# Altium project RFC_MB.PrjPcb (part 3 of 7)

## Sheet ethernet_1gbe_ext_magn.SchDoc
size A4
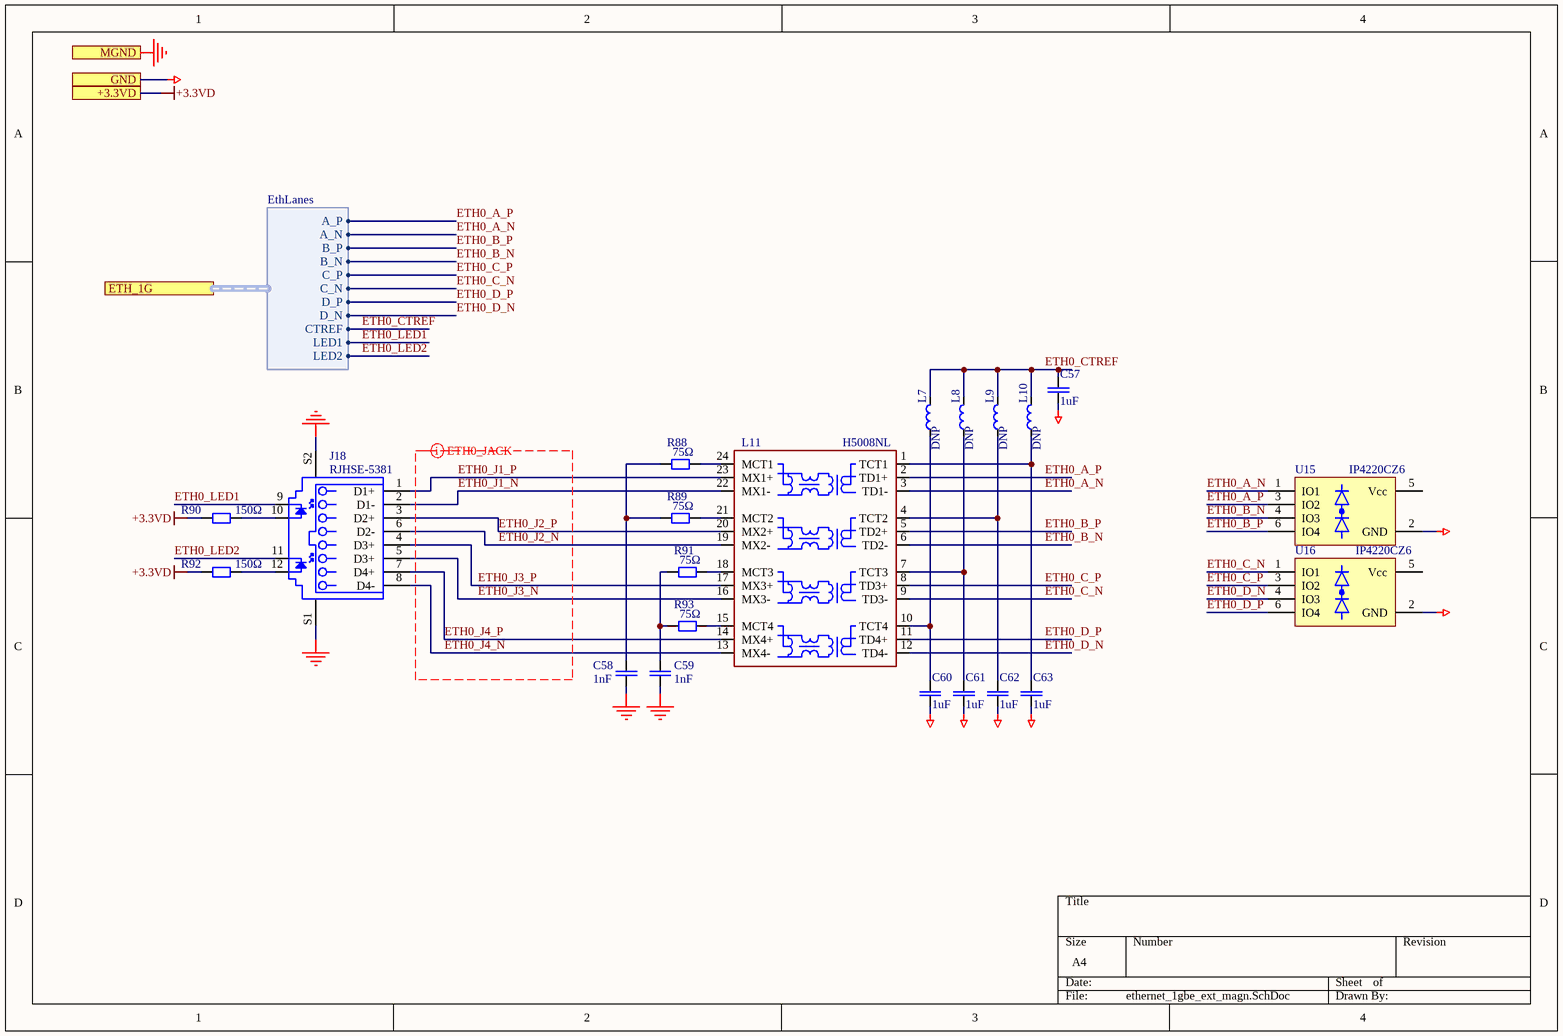
[diagram p4: ethernet_1gbe_ext_magn.SchDoc]

### Parts
C57  1uF  [CAPC2012N]
C58  value 1nF  [CAPC3216N]  (hidden comment: 1nF; 2kV)
C59  value 1nF  [CAPC3216N]  (hidden comment: 1nF; 2kV)
C60  1uF  [CAPC2012N]
C61  1uF  [CAPC2012N]
C62  1uF  [CAPC2012N]
C63  1uF  [CAPC2012N]
J18  RJHSE-5381  [AMPH-RJHSE-5381_V]
L7  DNP  [INDC2012N]
L8  DNP  [INDC2012N]
L9  DNP  [INDC2012N]
L10  DNP  [INDC2012N]
L11  H5008NL  [SMD_HX508]
R88  75Ω  [RESC2012N]
R89  75Ω  [RESC2012N]
R90  150Ω  [RESC2012N]
R91  75Ω  [RESC2012N]
R92  150Ω  [RESC2012N]
R93  75Ω  [RESC2012N]
U15  IP4220CZ6  [SOT95P285X110-6N]
U16  IP4220CZ6  [SOT95P285X110-6N]

### Ports
+3.3VD, ETH_1G (harness EthLanes), GND, MGND

### Harnesses
EthLanes: A_P, A_N, B_P, B_N, C_P, C_N, D_P, D_N, LED1, LED2, CTREF

### Nets
+3.3VD: R90.1 R92.1 ; port +3.3VD
GND: C57.1 C60.1 C61.1 C62.1 C63.1 U15.2(GND) U16.2(GND) ; port GND
MGND: C58.1 C59.1 J18.S1 J18.S2 ; port MGND
ETH0_A_N: L11.3(TD1-) U15.1(IO1) ; port ETH_1G.A_N
ETH0_A_P: L11.2(TD1+) U15.3(IO2) ; port ETH_1G.A_P
ETH0_B_N: L11.6(TD2-) U15.4(IO3) ; port ETH_1G.B_N
ETH0_B_P: L11.5(TD2+) U15.6(IO4) ; port ETH_1G.B_P
ETH0_C_N: L11.9(TD3-) U16.1(IO1) ; port ETH_1G.C_N
ETH0_C_P: L11.8(TD3+) U16.3(IO2) ; port ETH_1G.C_P
ETH0_CTREF: C57.2 L7.2 L8.2 L9.2 L10.2 ; port ETH_1G.CTREF
ETH0_D_N: L11.12(TD4-) U16.4(IO3) ; port ETH_1G.D_N
ETH0_D_P: L11.11(TD4+) U16.6(IO4) ; port ETH_1G.D_P
ETH0_J1_N: J18.2(D1-) L11.22(MX1-)
ETH0_J1_P: J18.1(D1+) L11.23(MX1+)
ETH0_J2_N: J18.6(D2-) L11.19(MX2-)
ETH0_J2_P: J18.3(D2+) L11.20(MX2+)
ETH0_J3_N: J18.5(D3+) L11.16(MX3-)
ETH0_J3_P: J18.4(D3+) L11.17(MX3+)
ETH0_J4_N: J18.8(D4-) L11.13(MX4-)
ETH0_J4_P: J18.7(D4+) L11.14(MX4+)
ETH0_LED1: J18.9 ; port ETH_1G.LED1
ETH0_LED2: J18.11 ; port ETH_1G.LED2
NetC58_2: C58.2 R88.1 R89.1
NetC59_2: C59.2 R91.1 R93.1
NetC60_2: C60.2 L7.1 L11.10(TCT4)
NetC61_2: C61.2 L8.1 L11.7(TCT3)
NetC62_2: C62.2 L9.1 L11.4(TCT2)
NetC63_2: C63.2 L10.1 L11.1(TCT1)
NetJ18_10: J18.10 R90.2
NetJ18_12: J18.12 R92.2
NetL11_15: L11.15(MCT4) R93.2
NetL11_18: L11.18(MCT3) R91.2
NetL11_21: L11.21(MCT2) R89.2
NetL11_24: L11.24(MCT1) R88.2

Not connected (* = marked no-connect by the designer): U15 5(Vcc); U16 5(Vcc)

### Layout directives
differential pair; rule Differential Pairs Routing [Pref Gap = 0.254mm    Min Gap  = 0.075mm    Max Gap  = 0.254mmPref Width = 0.3mm    Min Width  = 0.075mm    Max Width  = 0.5mm]: ETH0_J1_N, ETH0_J1_P, ETH0_J2_N, ETH0_J2_P, ETH0_J3_N, ETH0_J3_P, ETH0_J4_N, ETH0_J4_P

### Library data of the parts
C57 C60-C63 = CAPC: Generic ceramic SMD capacitor; Pkg: 0805; Maintainer: Evgeniy Kotov; SMD Solders: 2; THD Solders: 0; Voltage Rating: 10V; PartField: 1uF; Last Change Data: 06.03.2017; Release Date: 06.03.2017; Value: 1uF
C58 = CAPC: Generic ceramic SMD capacitor / +' x '+Voltage Rating; Pkg: 1206; Maintainer: Evgeniy Kotov; SMD Solders: 2; THD Solders: 0; PartField: 1nF; Last Change Data: 06.03.2017; Release Date: 06.03.2017; VoltageRating: 2kV
C59 = CAPC: Generic ceramic SMD capacitor; Pkg: 1206; Maintainer: Evgeniy Kotov; SMD Solders: 2; THD Solders: 0; PartField: 1nF; Last Change Data: 06.03.2017; Release Date: 06.03.2017; VoltageRating: 2kV
J18 = RJ45-RJHSE-5381: High Speed RJ45, Modular Jack, 8 Position, 8 Contacts, Shielded, with LEDs, -55 to 85 degC,12-Pin THD, RoHS, Tray; Manufacturer: Amphenol; Number of Positions/Contacts: 8p8c(RJ45,Ethernet); Number of Ports: 1; Catalog Drawings: RJ45SeriesRightAngle; PCN Design/Specification: MultipleSeriesCopper29/Jan/2009RJHSEShieldMaterial30/Jun/2015; Other Names: RJHSE5381; Online Catalog: RJHSESeries; Featured Product: ModularJacksProductSolutions; Tab Direction: Up; Shielding: Shielded,EMIFinger; LED Color: Yellow-Green; 3D Model: RJHSE538x.stpRJHSE538x.igs; Pkg: LAN conn; SMD Solders: 0; THD Solders: 14; Category: Connectors,Interconnects; Termination: Solder; Housing Material: Thermoplastic; Mounting Type: ThroughHole; Family: ModularConnectors-Jacks; Orientation: 90°Angle(Right); Features: BoardLock; Contact Material: PhosphorBronze; Mounting Technology: ThroughHole; Number of Rows: 1; Standard Package: 120; Ratings: -; Operating Temperature: -55°C~85°C; Series: RJHSE; Contact Finish: Gold; Package Reference: RJHSE-5381; Ingress Protection: -; Package Description: 12-Pin Through Hole Device, Body 16.51 x 15.75 mm; Contact Finish Thickness: 50µin(1.27µm); Datasheet URL: https://datasheet.ciiva.com/16481/rjhse538x-16481714.pdf; Datasheet Version: Rev. K, 04/2014; Connector Type: Jack; Manufacturer URL: http://www.amphenol.com/; Packaging: Tray; PartField: RJHSE-5381; Value: RJHSE-5381
L7-L10 = BLM21RK102SN1D: Ferrite Beads, 0805, 1 kOhm; Pkg: 0805; Vendor: Murata; Maintainer: Evgeniy Kotov; SMD Solders: 2; THD Solders: 0; DC Current: 200mA; Tolerance: 25%; DC Resistance: 500mΩ; PartField: BLM21RK102SN1D; Release Date: 30.03.2017; Last Change Data: 30.03.2017; Temperature Range: -55°C to +125°C; Value: DNP
L11 = LAN_1G_TR_H5008NL: LAN Transformer fog 1GbE, 12 coils, 4 pairs.; Vendor: Pulse Electronics; Maintainer: Evgeniy Kotov; SMD Solders: 2; THD Solders: 0; Tolerance: 2%; PartField: H5008NL; Pkg: H5008NL; Release Date: 31.03.2017; Last Change Data: 31.03.2017; Temperature Range: -25°C to +85°C; Value: H5008NL
R88-R93 = RESC: Resistor, Generic, SMD; Pkg: 0805; Maintainer: Evgeniy Kotov; SMD Solders: 2; THD Solders: 0; Release Date: 06.03.2017; Last Change Data: 09.03.2017
  R88 R89 R91 R93: PartField: 75Ω; Value: 75Ω
  R90 R92: PartField: 150Ω; Value: 150Ω
U15 U16 = IP4220CZ6: Transimpedance Amplifier; Selectable-Feedback Resistance; Pkg: SOT457; SMD Solders: 6; THD Solders: 0; Maintainer: Evgeniy Kotov; Vendor: NXP; PartField: IP4220CZ6; ComponentLink1URL: http://assets.nexperia.com/documents/data-sheet/IP4220CZ6.pdf; ComponentLink1Description: Datasheet; Last Change Date: 28.03.2017; Release Date: 28.03.2017; Value: IP4220CZ6

## Sheet ethernet_dual_100mbe_ext_magn.SchDoc
size A4
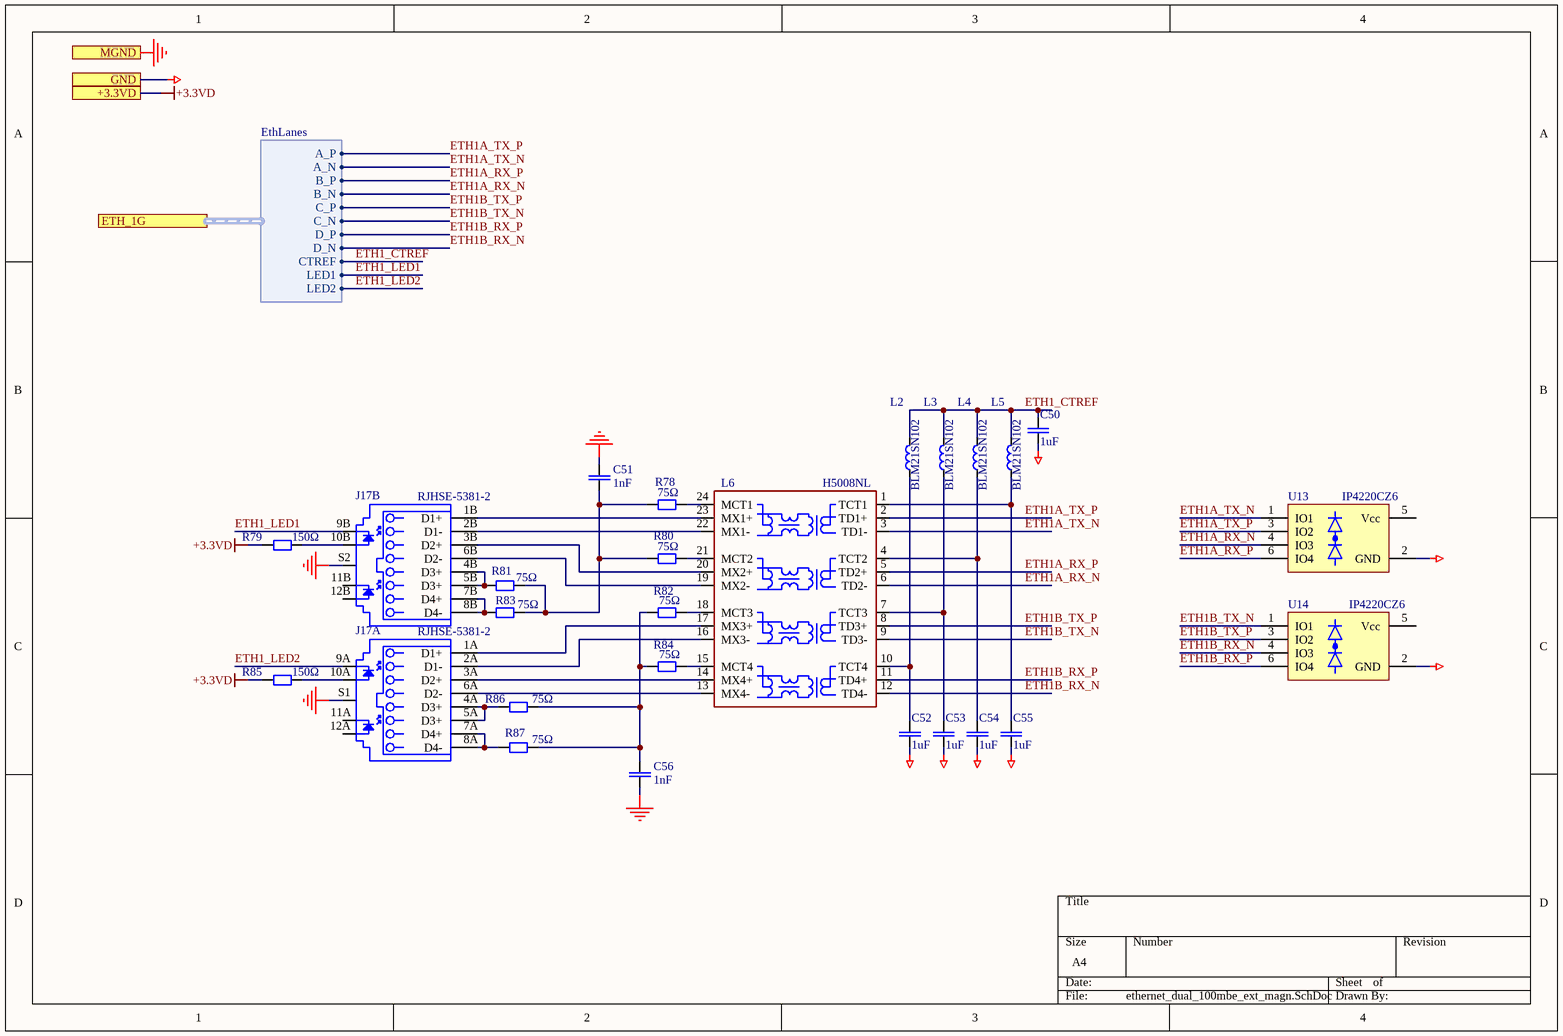
[diagram p5: ethernet_dual_100mbe_ext_magn.SchDoc]

### Parts
C50  1uF  [CAPC2012N]
C51  value 1nF  [CAPC3216N]  (hidden comment: 1nF; 2kV)
C52  1uF  [CAPC2012N]
C53  1uF  [CAPC2012N]
C54  1uF  [CAPC2012N]
C55  1uF  [CAPC2012N]
C56  value 1nF  [CAPC3216N]  (hidden comment: 1nF; 2kV)
J17  RJHSE-5381-2  [AMPH-RJHSE-5381-02_V]  (parts A,B of 2)
L2  value BLM21SN102  [INDC2012N]  (hidden comment: BLM21RK102SN1D)
L3  value BLM21SN102  [INDC2012N]  (hidden comment: BLM21RK102SN1D)
L4  value BLM21SN102  [INDC2012N]  (hidden comment: BLM21RK102SN1D)
L5  value BLM21SN102  [INDC2012N]  (hidden comment: BLM21RK102SN1D)
L6  H5008NL  [SMD_HX508]
R78  75Ω  [RESC2012N]
R79  150Ω  [RESC2012N]
R80  75Ω  [RESC2012N]
R81  75Ω  [RESC2012N]
R82  75Ω  [RESC2012N]
R83  75Ω  [RESC2012N]
R84  75Ω  [RESC2012N]
R85  150Ω  [RESC2012N]
R86  75Ω  [RESC2012N]
R87  75Ω  [RESC2012N]
U13  IP4220CZ6  [SOT95P285X110-6N]
U14  IP4220CZ6  [SOT95P285X110-6N]

### Ports
+3.3VD, ETH_1G (harness EthLanes), GND, MGND

### Harnesses
EthLanes: A_P, A_N, B_P, B_N, C_P, C_N, D_P, D_N, LED1, LED2, CTREF

### Nets
+3.3VD: R79.1 R85.1 ; port +3.3VD
GND: C50.1 C52.1 C53.1 C54.1 C55.1 U13.2(GND) U14.2(GND) ; port GND
MGND: C51.2 C56.1 J17.S1 J17.S2 ; port MGND
ETH1_CTREF: C50.2 L2.2 L3.2 L4.2 L5.2 ; port ETH_1G.CTREF
ETH1_LED1: J17.9B ; port ETH_1G.LED1
ETH1_LED2: J17.9A ; port ETH_1G.LED2
ETH1A_RX_N: L6.6(TD2-) U13.4(IO3) ; port ETH_1G.B_N
ETH1A_RX_P: L6.5(TD2+) U13.6(IO4) ; port ETH_1G.B_P
ETH1A_TX_N: L6.3(TD1-) U13.1(IO1) ; port ETH_1G.A_N
ETH1A_TX_P: L6.2(TD1+) U13.3(IO2) ; port ETH_1G.A_P
ETH1B_RX_N: L6.12(TD4-) U14.4(IO3) ; port ETH_1G.D_N
ETH1B_RX_P: L6.11(TD4+) U14.6(IO4) ; port ETH_1G.D_P
ETH1B_TX_N: L6.9(TD3-) U14.1(IO1) ; port ETH_1G.C_N
ETH1B_TX_P: L6.8(TD3+) U14.3(IO2) ; port ETH_1G.C_P
NetC51_1: C51.1 R78.1 R80.1 R81.2 R83.2
NetC52_2: C52.2 L2.1 L6.10(TCT4)
NetC53_2: C53.2 L3.1 L6.7(TCT3)
NetC54_2: C54.2 L4.1 L6.4(TCT2)
NetC55_2: C55.2 L5.1 L6.1(TCT1)
NetC56_2: C56.2 R82.1 R84.1 R86.2 R87.2
NetJ17_1A: J17.1A(D1+) L6.17(MX3+)
NetJ17_1B: J17.1B(D1+) L6.23(MX1+)
NetJ17_2A: J17.2A(D1-) L6.16(MX3-)
NetJ17_2B: J17.2B(D1-) L6.22(MX1-)
NetJ17_3A: J17.3A(D2+) L6.14(MX4+)
NetJ17_3B: J17.3B(D2+) L6.20(MX2+)
NetJ17_4A: J17.4A(D3+) J17.5A(D3+) R86.1
NetJ17_4B: J17.4B(D3+) J17.5B(D3+) R81.1
NetJ17_6A: J17.6A(D2-) L6.13(MX4-)
NetJ17_6B: J17.6B(D2-) L6.19(MX2-)
NetJ17_7A: J17.7A(D4+) J17.8A(D4-) R87.1
NetJ17_7B: J17.7B(D4+) J17.8B(D4-) R83.1
NetJ17_10A: J17.10A R85.2
NetJ17_10B: J17.10B R79.2
NetL6_15: L6.15(MCT4) R84.2
NetL6_18: L6.18(MCT3) R82.2
NetL6_21: L6.21(MCT2) R80.2
NetL6_24: L6.24(MCT1) R78.2

Not connected (* = marked no-connect by the designer): J17 11A(11) 11B(11) 12A(12) 12B(12); U13 5(Vcc); U14 5(Vcc)

### Library data of the parts
C50 C52-C55 = CAPC: as C57 on sheet ethernet_1gbe_ext_magn; PartField: 1uF; Last Change Data: 06.03.2017; Release Date: 06.03.2017; Value: 1uF
C51 C56 = CAPC: as C59 on sheet ethernet_1gbe_ext_magn; PartField: 1nF; Last Change Data: 06.03.2017; Release Date: 06.03.2017; VoltageRating: 2kV
J17 = RJ45-RJHSE-5381-2: Dual Port, High Speed RJ45, Modular Jack, 8 Position, 8 Contacts, Shielded, with LEDs, -55 to 85 degC,12-Pin THD, RoHS, Tray; Manufacturer: Amphenol; Number of Positions/Contacts: 8p8c(RJ45,Ethernet); Number of Ports: 1; Catalog Drawings: RJ45SeriesRightAngle; PCN Design/Specification: MultipleSeriesCopper29/Jan/2009RJHSEShieldMaterial30/Jun/2015; Other Names: RJHSE5381; Online Catalog: RJHSESeries; Featured Product: ModularJacksProductSolutions; Tab Direction: Up; Shielding: Shielded,EMIFinger; LED Color: Yellow-Green; 3D Model: RJHSE538x.stpRJHSE538x.igs; Pkg: LAN x2; SMD Solders: 0; THD Solders: 28; Category: Connectors,Interconnects; Termination: Solder; Housing Material: Thermoplastic; Mounting Type: ThroughHole; Family: ModularConnectors-Jacks; Orientation: 90°Angle(Right); Features: BoardLock; Contact Material: PhosphorBronze; Mounting Technology: ThroughHole; Number of Rows: 1; Standard Package: 120; Ratings: -; Operating Temperature: -55°C~85°C; Series: RJHSE; Contact Finish: Gold; Package Reference: RJHSE-5381; Ingress Protection: -; Package Description: 12-Pin Through Hole Device, Body 16.51 x 15.75 mm; Contact Finish Thickness: 50µin(1.27µm); Datasheet URL: https://datasheet.ciiva.com/16481/rjhse538x-16481714.pdf; Datasheet Version: Rev. K, 04/2014; Connector Type: Jack; Manufacturer URL: http://www.amphenol.com/; Packaging: Tray; PartField: RJHSE-5381-2; Value: RJHSE-5381-2
L2-L5 = BLM21RK102SN1D: as L7 on sheet ethernet_1gbe_ext_magn; PartField: BLM21RK102SN1D; Release Date: 30.03.2017; Last Change Data: 30.03.2017; Temperature Range: -55°C to +125°C
L6 = LAN_1G_TR_H5008NL: as L11 on sheet ethernet_1gbe_ext_magn; PartField: H5008NL; Pkg: H5008NL; Release Date: 31.03.2017; Last Change Data: 31.03.2017; Temperature Range: -25°C to +85°C; Value: H5008NL
R78-R87 = RESC: as R88-R93 on sheet ethernet_1gbe_ext_magn; Release Date: 06.03.2017; Last Change Data: 09.03.2017
  R78 R80-R84 R86 R87: PartField: 75Ω; Value: 75Ω
  R79 R85: PartField: 150Ω; Value: 150Ω
U13 U14 = IP4220CZ6: as U15 on sheet ethernet_1gbe_ext_magn; PartField: IP4220CZ6; ComponentLink1URL: http://assets.nexperia.com/documents/data-sheet/IP4220CZ6.pdf; ComponentLink1Description: Datasheet; Last Change Date: 28.03.2017; Release Date: 28.03.2017; Value: IP4220CZ6

## Sheet uart_adm3222.SchDoc
size A4
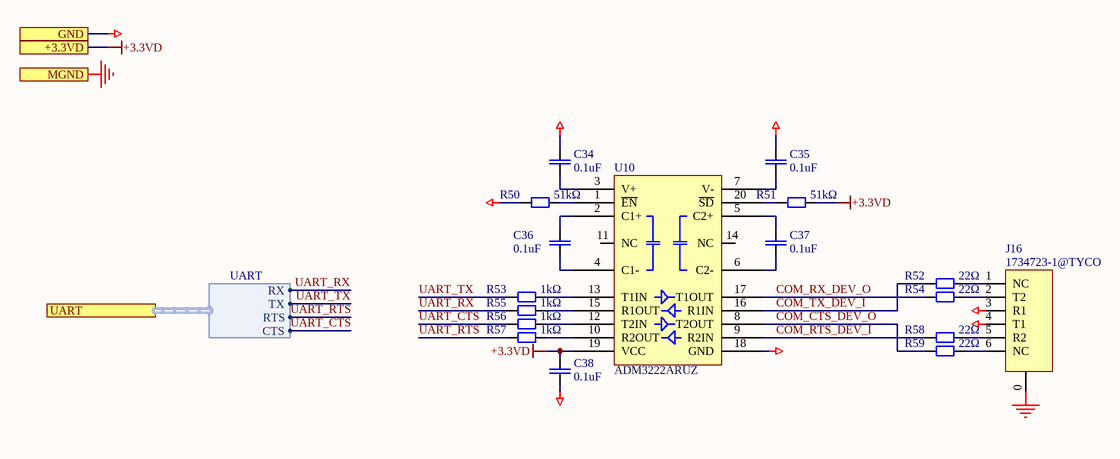
[diagram p6: uart_adm3222.SchDoc]

### Parts
C34  0.1uF  [CAPC2012N]
C35  0.1uF  [CAPC2012N]
C36  0.1uF  [CAPC2012N]
C37  0.1uF  [CAPC2012N]
C38  0.1uF  [CAPC2012N]
J16  1734723-1@TYCO  [RJ14]
R50  51kΩ  [RESC2012N]
R51  51kΩ  [RESC2012N]
R52  22Ω  [RESC1608N]
R53  1kΩ  [RESC2012N]
R54  22Ω  [RESC1608N]
R55  1kΩ  [RESC2012N]
R56  1kΩ  [RESC2012N]
R57  1kΩ  [RESC2012N]
R58  22Ω  [RESC1608N]
R59  22Ω  [RESC1608N]
U10  ADM3222ARUZ  [SOP65P640X110-20N]

### Ports
+3.3VD, GND, MGND, UART (harness UART)

### Harnesses
UART: RX, TX, RTS, CTS

### Nets
+3.3VD: C38.2 R51.2 U10.19(VCC) ; port +3.3VD
GND: C34.2 C35.2 C38.1 J16.3(R1) J16.4(T1) R50.1 U10.18(GND) ; port GND
MGND: J16.0 ; port MGND
COM_CTS_DEV_O: R59.1 U10.8(T2OUT)
COM_RTS_DEV_I: R58.1 U10.9(R2IN)
COM_RX_DEV_O: R54.1 U10.17(T1OUT)
COM_TX_DEV_I: R52.1 U10.16(R1IN)
UART_CTS: R56.1 ; port UART.CTS
UART_RTS: R57.1 ; port UART.RTS
UART_RX: R55.1 ; port UART.RX
UART_TX: R53.1 ; port UART.TX
NetC34_1: C34.1 U10.3(V+)
NetC35_1: C35.1 U10.7(V-)
NetC36_1: C36.1 U10.4(C1-)
NetC36_2: C36.2 U10.2(C1+)
NetC37_1: C37.1 U10.6(C2-)
NetC37_2: C37.2 U10.5(C2+)
NetJ16_1: J16.1(NC) R52.2
NetJ16_2: J16.2(T2) R54.2
NetJ16_5: J16.5(R2) R58.2
NetJ16_6: J16.6(NC) R59.2
NetR50_2: R50.2 U10.1(~{EN})
NetR51_1: R51.1 U10.20(~{SD})
NetR53_2: R53.2 U10.13(T1IN)
NetR55_2: R55.2 U10.15(R1OUT)
NetR56_2: R56.2 U10.12(T2IN)
NetR57_2: R57.2 U10.10(R2OUT)

Not connected (* = marked no-connect by the designer): U10 11(NC) 14(NC)

### Library data of the parts
C34-C38 = CAPC: Generic ceramic SMD capacitor; Pkg: 0805; Maintainer: Evgeniy Kotov; SMD Solders: 2; THD Solders: 0; PartField: 0.1uF; Last Change Data: 06.03.2017; Release Date: 06.03.2017; Value: 0.1uF
J16 = RJ-14: Pkg: RJ14-6p; SMD Solders: 0; THD Solders: 10; PartField: 1734723-1@TYCO; Value: 1734723-1@TYCO
R50 R51 R53 R55-R57 = RESC: as R88-R93 on sheet ethernet_1gbe_ext_magn; Release Date: 06.03.2017; Last Change Data: 09.03.2017
  R50 R51: PartField: 51kΩ; Value: 51kΩ
  R53 R55-R57: PartField: 1kΩ; Value: 1kΩ
R52 R54 R58 R59 = RESC: Resistor, Generic, SMD; Pkg: 0603; Maintainer: Evgeniy Kotov; SMD Solders: 2; THD Solders: 0; PartField: 22Ω; Release Date: 06.03.2017; Last Change Data: 09.03.2017; Value: 22Ω
U10 = ADM3222ARU: RS232; Pkg: TSSOP-20; SMD Solders: 20; THD Solders: 0; Vendor: Analog Devices; ComponentLink1URL: https://www.analog.com/media/en/technical-documentation/data-sheets/ADM3202_3222_1385.pdf; Last Change Date: 24.05.2019; PartField: ADM3222ARUZ; Value: ADM3222

## Sheet jtag.SchDoc
size A4
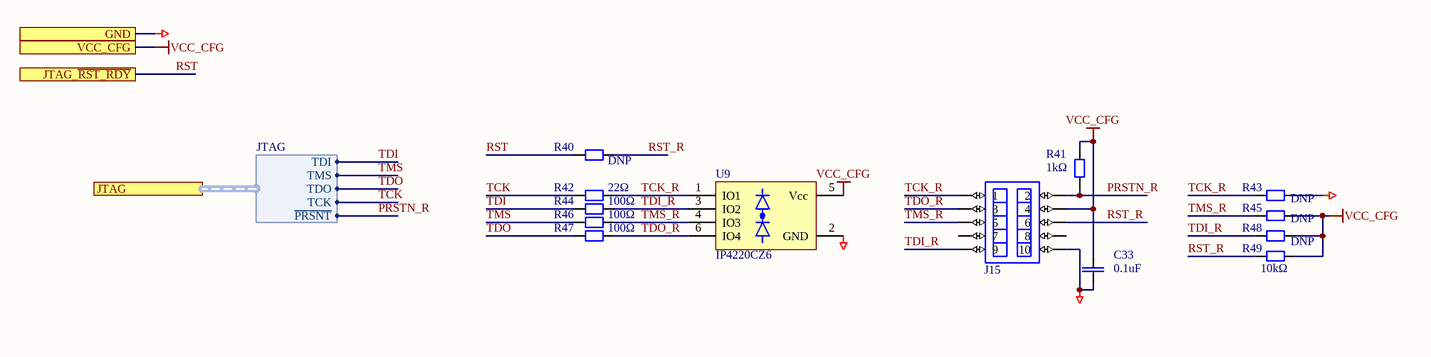
[diagram p7: jtag.SchDoc]

### Parts
C33  0.1uF  [CAPC2012N]
J15  IDC-10MC  [PLD-10]  (value not drawn)
R40  DNP  [RESC1608N]
R41  1kΩ  [RESC2012N]
R42  22Ω  [RESC1608N]
R43  DNP  [RESC2012N]
R44  100Ω  [RESC1608N]
R45  DNP  [RESC2012N]
R46  100Ω  [RESC1608N]
R47  100Ω  [RESC1608N]
R48  DNP  [RESC2012N]
R49  10kΩ  [RESC2012N]
U9  IP4220CZ6  [SOT95P285X110-6N]

### Ports
GND, JTAG (harness JTAG), JTAG_~{RST_RDY}, VCC_CFG

### Harnesses
JTAG: TDI, TMS, TDO, TCK, ~{PRSNT}

### Nets
GND: C33.1 J15.10 R43.2 U9.2(GND) ; port GND
VCC_CFG: C33.2 J15.4 R41.2 R45.2 R48.2 R49.2 U9.5(Vcc) ; port VCC_CFG  [project net +3.3VD]
PRSTN_R: J15.2 R41.1 ; port JTAG.~{PRSNT}  [project net JTAG_~{PRSNT}]
RST: R40.1 ; port JTAG_~{RST_RDY}  [project net HPS_RSTn]
RST_R: J15.6 R40.2 R49.1
TCK: R42.1 ; port JTAG.TCK  [project net JTAG_TCK]
TCK_R: J15.1 R42.2 R43.1 U9.1(IO1)
TDI: R44.1 ; port JTAG.TDI  [project net JTAG_TDI]
TDI_R: J15.9 R44.2 R48.1 U9.3(IO2)
TDO: R47.1 ; port JTAG.TDO  [project net JTAG_TDO]
TDO_R: J15.3 R47.2 U9.6(IO4)
TMS: R46.1 ; port JTAG.TMS  [project net JTAG_TMS]
TMS_R: J15.5 R45.1 R46.2 U9.4(IO3)

Not connected (* = marked no-connect by the designer): J15 7 8

### Library data of the parts
C33 = CAPC: as C34-C38 on sheet uart_adm3222; PartField: 0.1uF; Last Change Data: 06.03.2017; Release Date: 06.03.2017; Value: 0.1uF
J15 = IDC-10MS: Connector, 5x2, Male, 2.54mm Pitch, Strait contacts, with Body; SMD Solders: 0; THD Solders: 10; Maintainer: Evgeniy Kotov; Pkg: IDC-10; PartField: IDC-10MC; Last Change Data: 28.03.2017; Release Date: 28.03.2017; Value: IDC-10MC; ComponentLink1Description: Datasheet
R40 = RESC: Resistor, Generic, SMD; PartField: 100Ω; Pkg: 0603; Maintainer: Evgeniy Kotov; SMD Solders: 2; THD Solders: 0; Release Date: 06.03.2017; Last Change Data: 09.03.2017; Value: DNP
R41 R49 = RESC: as R88-R93 on sheet ethernet_1gbe_ext_magn; Release Date: 06.03.2017; Last Change Data: 09.03.2017
  R41: PartField: 1kΩ; Value: 1kΩ
  R49: PartField: 10kΩ; Value: 10kΩ
R42 R44 R46 R47 = RESC: as R52 on sheet uart_adm3222; Release Date: 06.03.2017; Last Change Data: 09.03.2017
  R42: PartField: 22Ω; Value: 22Ω
  R44 R46 R47: PartField: 100Ω; Value: 100Ω
R43 = RESC: Resistor, Generic, SMD; PartField: 1kΩ; Pkg: 0805; Maintainer: Evgeniy Kotov; SMD Solders: 2; THD Solders: 0; Release Date: 06.03.2017; Last Change Data: 09.03.2017; Value: DNP
R45 R48 = RESC: Resistor, Generic, SMD; PartField: 10kΩ; Pkg: 0805; Maintainer: Evgeniy Kotov; SMD Solders: 2; THD Solders: 0; Release Date: 06.03.2017; Last Change Data: 09.03.2017; Value: DNP
U9 = IP4220CZ6: as U15 on sheet ethernet_1gbe_ext_magn; PartField: IP4220CZ6; ComponentLink1URL: http://assets.nexperia.com/documents/data-sheet/IP4220CZ6.pdf; ComponentLink1Description: Datasheet; Last Change Date: 28.03.2017; Release Date: 28.03.2017; Value: IP4220CZ6

## Sheet sdcard_emmc.SchDoc
size A4
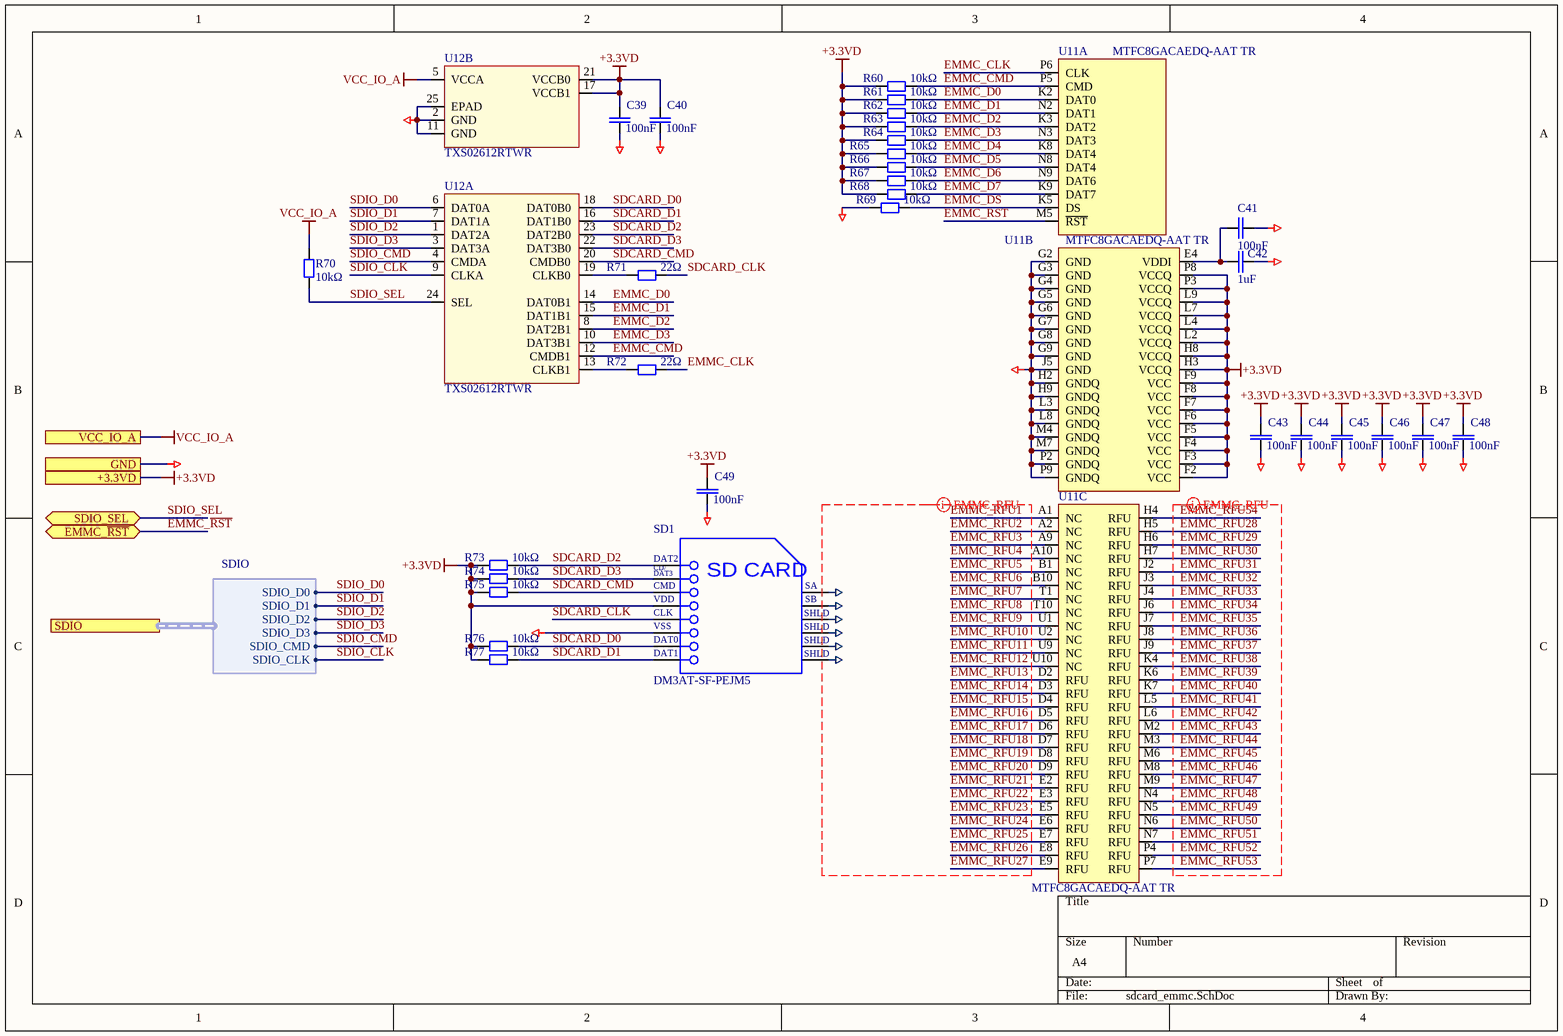
[diagram p8: sdcard_emmc.SchDoc]

### Parts
C39  100nF  [CAPC1608N]
C40  100nF  [CAPC1608N]
C41  100nF  [CAPC1608N]
C42  1uF  [CAPC2012N]
C43  100nF  [CAPC1608N]
C44  100nF  [CAPC1608N]
C45  100nF  [CAPC1608N]
C46  100nF  [CAPC1608N]
C47  100nF  [CAPC1608N]
C48  100nF  [CAPC1608N]
C49  100nF  [CAPC1608N]
R60  10kΩ  [RESC2012N]
R61  10kΩ  [RESC2012N]
R62  10kΩ  [RESC2012N]
R63  10kΩ  [RESC2012N]
R64  10kΩ  [RESC2012N]
R65  10kΩ  [RESC2012N]
R66  10kΩ  [RESC2012N]
R67  10kΩ  [RESC2012N]
R68  10kΩ  [RESC2012N]
R69  10kΩ  [RESC2012N]
R70  10kΩ  [RESC2012N]
R71  22Ω  [RESC1608N]
R72  22Ω  [RESC1608N]
R73  10kΩ  [RESC2012N]
R74  10kΩ  [RESC2012N]
R75  10kΩ  [RESC2012N]
R76  10kΩ  [RESC2012N]
R77  10kΩ  [RESC2012N]
SD1  DM3AT-SF-PEJM5  [SD_HRS-DM3AT-8_V]
U11  MTFC8GACAEDQ-AAT TR  [BGA100C100P10X17_1400X1800X120]  (parts A,B,C of 3)
U12  TXS02612RTWR  [QFN50P400X400X80-25N-S245]  (parts A,B of 2)

### Ports
+3.3VD, EMMC_~{RST} (bidir), GND, SDIO (harness SDIO), SDIO_SEL (bidir), VCC_IO_A

### Harnesses
SDIO: SDIO_D0, SDIO_D1, SDIO_D2, SDIO_D3, SDIO_CMD, SDIO_CLK

### Nets
+3.3VD: C39.1 C40.1 C43.1 C44.1 C45.1 C46.1 C47.1 C48.1 C49.1 R60.1 R61.1 R62.1 R63.1 R64.1 R65.1 R66.1 R67.1 R68.1 R70.2 R73.1 R74.1 R75.1 R76.1 R77.1 SD1.4(VDD) U11.F2(VCC) U11.F3(VCC) U11.F4(VCC) U11.F5(VCC) U11.F6(VCC) U11.F7(VCC) U11.F8(VCC) U11.F9(VCC) U11.H3(VCCQ) U11.H8(VCCQ) U11.L2(VCCQ) U11.L4(VCCQ) U11.L7(VCCQ) U11.L9(VCCQ) U11.P3(VCCQ) U11.P8(VCCQ) U12.5(VCCA) U12.17(VCCB1) U12.21(VCCB0) ; port +3.3VD, port VCC_IO_A  [also labelled VCC_IO_A]
GND: C39.2 C40.2 C41.2 C42.1 C43.2 C44.2 C45.2 C46.2 C47.2 C48.2 C49.2 R69.1 SD1.6(VSS) U11.G2(GND) U11.G3(GND) U11.G4(GND) U11.G5(GND) U11.G6(GND) U11.G7(GND) U11.G8(GND) U11.G9(GND) U11.H2(GNDQ) U11.H9(GNDQ) U11.J5(GND) U11.L3(GNDQ) U11.L8(GNDQ) U11.M4(GNDQ) U11.M7(GNDQ) U11.P2(GNDQ) U11.P9(GNDQ) U12.2(GND) U12.11(GND) U12.25(EPAD) ; port GND
SDEPAD1: SD1.9(SA)
SDEPAD2: SD1.10(SB)
SDEPAD3: SD1.11(SHLD)
SDEPAD4: SD1.13(SHLD)
SDEPAD5: SD1.12(SHLD)
SDEPAD6: SD1.14(SHLD)
EMMC_CLK: R72.2 U11.P6(CLK)
EMMC_CMD: R60.2 U11.P5(CMD) U12.12(CMDB1)
EMMC_D0: R61.2 U11.K2(DAT0) U12.14(DAT0B1)
EMMC_D1: R62.2 U11.N2(DAT1) U12.15(DAT1B1)
EMMC_D2: R63.2 U11.K3(DAT2) U12.8(DAT2B1)
EMMC_D3: R64.2 U11.N3(DAT3) U12.10(DAT3B1)
EMMC_D4: R65.2 U11.K8(DAT4)
EMMC_D5: R66.2 U11.N8(DAT4)
EMMC_D6: R67.2 U11.N9(DAT6)
EMMC_D7: R68.2 U11.K9(DAT7)
EMMC_DS: R69.2 U11.K5(DS)
EMMC_~{RST}: U11.M5(~{RST}) ; port EMMC_~{RST}  [project net HPS_PORn]
EMMC_RFU1: U11.A1(NC)
EMMC_RFU2: U11.A2(NC)
EMMC_RFU3: U11.A9(NC)
EMMC_RFU4: U11.A10(NC)
EMMC_RFU5: U11.B1(NC)
EMMC_RFU6: U11.B10(NC)
EMMC_RFU7: U11.T1(NC)
EMMC_RFU8: U11.T10(NC)
EMMC_RFU9: U11.U1(NC)
EMMC_RFU10: U11.U2(NC)
EMMC_RFU11: U11.U9(NC)
EMMC_RFU12: U11.U10(NC)
EMMC_RFU13: U11.D2(RFU)
EMMC_RFU14: U11.D3(RFU)
EMMC_RFU15: U11.D4(RFU)
EMMC_RFU16: U11.D5(RFU)
EMMC_RFU17: U11.D6(RFU)
EMMC_RFU18: U11.D7(RFU)
EMMC_RFU19: U11.D8(RFU)
EMMC_RFU20: U11.D9(RFU)
EMMC_RFU21: U11.E2(RFU)
EMMC_RFU22: U11.E3(RFU)
EMMC_RFU23: U11.E5(RFU)
EMMC_RFU24: U11.E6(RFU)
EMMC_RFU25: U11.E7(RFU)
EMMC_RFU26: U11.E8(RFU)
EMMC_RFU27: U11.E9(RFU)
EMMC_RFU28: U11.H5(RFU)
EMMC_RFU29: U11.H6(RFU)
EMMC_RFU30: U11.H7(RFU)
EMMC_RFU31: U11.J2(RFU)
EMMC_RFU32: U11.J3(RFU)
EMMC_RFU33: U11.J4(RFU)
EMMC_RFU34: U11.J6(RFU)
EMMC_RFU35: U11.J7(RFU)
EMMC_RFU36: U11.J8(RFU)
EMMC_RFU37: U11.J9(RFU)
EMMC_RFU38: U11.K4(RFU)
EMMC_RFU39: U11.K6(RFU)
EMMC_RFU40: U11.K7(RFU)
EMMC_RFU41: U11.L5(RFU)
EMMC_RFU42: U11.L6(RFU)
EMMC_RFU43: U11.M2(RFU)
EMMC_RFU44: U11.M3(RFU)
EMMC_RFU45: U11.M6(RFU)
EMMC_RFU46: U11.M8(RFU)
EMMC_RFU47: U11.M9(RFU)
EMMC_RFU48: U11.N4(RFU)
EMMC_RFU49: U11.N5(RFU)
EMMC_RFU50: U11.N6(RFU)
EMMC_RFU51: U11.N7(RFU)
EMMC_RFU52: U11.P4(RFU)
EMMC_RFU53: U11.P7(RFU)
EMMC_RFU54: U11.H4(RFU)
SDCARD_CLK: R71.2 SD1.5(CLK)
SDCARD_CMD: R75.2 SD1.3(CMD) U12.20(CMDB0)
SDCARD_D0: R76.2 SD1.7(DAT0) U12.18(DAT0B0)
SDCARD_D1: R77.2 SD1.8(DAT1) U12.16(DAT1B0)
SDCARD_D2: R73.2 SD1.1(DAT2) U12.23(DAT2B0)
SDCARD_D3: R74.2 SD1.2(CD/DAT3) U12.22(DAT3B0)
SDIO_CLK: U12.9(CLKA) ; port SDIO.SDIO_CLK
SDIO_CMD: U12.4(CMDA) ; port SDIO.SDIO_CMD
SDIO_D0: U12.6(DAT0A) ; port SDIO.SDIO_D0
SDIO_D1: U12.7(DAT1A) ; port SDIO.SDIO_D1
SDIO_D2: U12.1(DAT2A) ; port SDIO.SDIO_D2
SDIO_D3: U12.3(DAT3A) ; port SDIO.SDIO_D3
SDIO_SEL: R70.1 U12.24(SEL) ; port SDIO_SEL
NetC41_1: C41.1 C42.2 U11.E4(VDDI)
NetR71_1: R71.1 U12.19(CLKB0)
NetR72_1: R72.1 U12.13(CLKB1)

### Layout directives
differential pair; net class EMMC_RFU: EMMC_RFU1, EMMC_RFU2, EMMC_RFU3, EMMC_RFU4, EMMC_RFU5, EMMC_RFU6, EMMC_RFU7, EMMC_RFU8, EMMC_RFU9, EMMC_RFU10, EMMC_RFU11, EMMC_RFU12, EMMC_RFU13, EMMC_RFU14, EMMC_RFU15, EMMC_RFU16, EMMC_RFU17, EMMC_RFU18, EMMC_RFU19, EMMC_RFU20, EMMC_RFU21, EMMC_RFU22, EMMC_RFU23, EMMC_RFU24, EMMC_RFU25, EMMC_RFU26, EMMC_RFU27, EMMC_RFU28, EMMC_RFU29, EMMC_RFU30, EMMC_RFU31, EMMC_RFU32, EMMC_RFU33, EMMC_RFU34, EMMC_RFU35, EMMC_RFU36, EMMC_RFU37, EMMC_RFU38, EMMC_RFU39, EMMC_RFU40, EMMC_RFU41, EMMC_RFU42, EMMC_RFU43, EMMC_RFU44, EMMC_RFU45, EMMC_RFU46, EMMC_RFU47, EMMC_RFU48, EMMC_RFU49, EMMC_RFU50, EMMC_RFU51, EMMC_RFU52, EMMC_RFU53, EMMC_RFU54, SDEPAD1, SDEPAD2, SDEPAD3, SDEPAD4, SDEPAD5, SDEPAD6

### Notes on the sheet
- (in symbol DM3AT-SF-PEJM5) CD/; DAT3; SD CARD

### Library data of the parts
C39-C41 C43-C49 = CAPC: Generic ceramic SMD capacitor; Pkg: 0603; Maintainer: Evgeniy Kotov; SMD Solders: 2; THD Solders: 0; PartField: 100nF; Last Change Data: 06.03.2017; Release Date: 06.03.2017; Value: 100nF
C42 = CAPC: as C57 on sheet ethernet_1gbe_ext_magn; PartField: 1uF; Last Change Data: 06.03.2017; Release Date: 06.03.2017; Value: 1uF
R60-R70 R73-R77 = RESC: as R88-R93 on sheet ethernet_1gbe_ext_magn; PartField: 10kΩ; Release Date: 06.03.2017; Last Change Data: 09.03.2017; Value: 10kΩ
R71 R72 = RESC: as R52 on sheet uart_adm3222; PartField: 22Ω; Release Date: 06.03.2017; Last Change Data: 09.03.2017; Value: 22Ω
SD1 = DM3AT-SF-PEJM5: Micro SD Card Connector, 0.5 A, 125 V, -25 to 85 degC, 8-Pin SMD, RoHS, Tape and Reel; Manufacturer: Hirose Electric; Featured Product: DM3ATSeries; HTML Datasheet: DM3SeriesmicroSD.html; Other Names: HR1964DKR; Connector Type: ConnectorandEjector; Insertion, Removal Method: PushIn,PushOut; Card Type: SecureDigital-microSD™; Online Catalog: DM3Series; Number of Positions: 10(8+2); Product Training Modules: DM3SeriesmicroSDCardSockets; Pkg: SD card hlder; SMD Solders: 14; THD Solders: 0; Manufacturer URL: https://www.hirose.com; Contact Finish: Gold; Family: MemoryConnectors-PCCardSockets; Package Reference: DM3AT-8; Category: Connectors,Interconnects; Features: Switch; Mounting Type: SurfaceMount,RightAngle; Datasheet Version: Jun-10; Package Description: 8-Pin Surface Mount Device, Body 16.15 x 13.85 mm, Pitch 1.1 mm; Standard Package: 1; Contact Finish Thickness: -; Datasheet URL: https://ciiva.com/datasheet-click-46418261?src=ciiva&sig=4019062a; Mounting Feature: Normal,Standard-Top; Series: DM3; Packaging: Digi-Reel; Package URL: https://www.hirose.com/product/en/download_file/key_name/DM3/category/Catalog/doc_file_id/49662/?file_category_id=4&item_id=195&is_series=1; Ejector Side: -; Value: DM3AT-SF-PEJM5; Vendor: Hirose Electric; PartField: DM3AT-SF-PEJM5
U11 = MTFC32GAKAENA: Pkg: LBGA-100; SMD Solders: 100; THD Solders: 0; Value: MTFC8GACAEDQ-AAT TR; PartField: MTFC8GACAEDQ-AAT TR
U12 = TXS02612_RTW_24: IC SDIO PORT EXPANDER AND LEVEL SHIFTER; Vendor: Texas Instruments; PACKAGE_DESIGNATOR: RTW; PIN_COUNT: 24; FAMILY_NAME: APPLICATION SPECIFIC (COMPACT FLASH, SD, MMC, I2C); INDUSTRY_STD_PKG_TYPE: QFN; Pkg: QFN-24EP; SMD Solders: 25; THD Solders: 0; Manufacturer_Part_Number: txs02612_rtw_24; GENERIC_PART_NUMBER: TXS02612RTWR; Datasheet URL: http://www.ti.com/lit/gpn/TXS02612; Manufacturer: Texas Instruments; RefDes: RefDes; Type: DEV; Value: TXS02612RTWR; PartField: TXS02612RTWR

## Sheet can_phy.SchDoc
size A4
Used 2 times, as channels U_can_phy, U_can_phy. Parts and nets are listed once, with the designators drawn on the sheet.
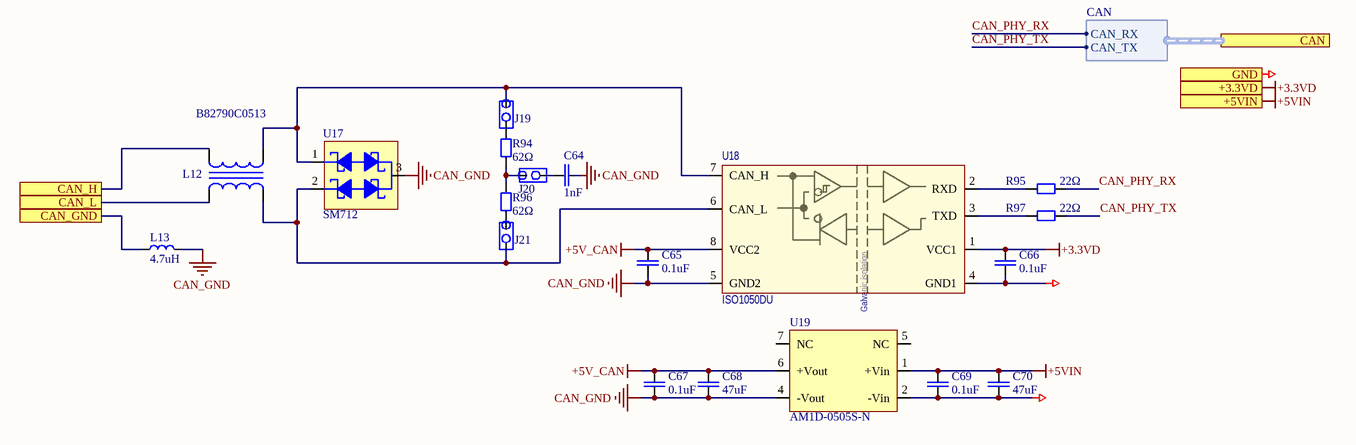
[diagram p9: can_phy.SchDoc]

### Parts
C64  value 1nF  [CAPC3216N]  (hidden comment: 1nF; 2kV)
C65  0.1uF  [CAPC2012N]
C66  0.1uF  [CAPC2012N]
C67  0.1uF  [CAPC2012N]
C68  47uF  [CAPC3216N]
C69  0.1uF  [CAPC2012N]
C70  47uF  [CAPC3216N]
J19  PLS-2  [PLS-2]  (value not drawn)
J20  PLS-2  [PLS-2]  (value not drawn)
J21  PLS-2  [PLS-2]  (value not drawn)
L12  B82790C0513  [SMD_B82790]
L13  value 4.7uH  [IND_3225_MURATA_LQH_N]  (hidden comment: LQH32PN4R7NN0L)
R94  62Ω  [RESC2012N]
R95  22Ω  [RESC1608N]
R96  62Ω  [RESC2012N]
R97  22Ω  [RESC1608N]
U17  SM712  [SOT95P240X110-3N]
U18  ISO1050DU  [SOP8]
U19  AM1D-0505S-N  [SIP-7]

### Ports
+3.3VD, +5VIN, CAN (harness CAN), CAN_GND, CAN_H, CAN_L, GND

### Harnesses
CAN: CAN_TX, CAN_RX

### Nets
+3.3VD: C66.2 U18.1(VCC1) ; port +3.3VD
+5V_CAN: C65.2 C67.2 C68.2 U18.8(VCC2) U19.6(+Vout)
+5VIN: C69.2 C70.2 U19.1(+Vin) ; port +5VIN
CAN_GND: C64.1 C65.1 C67.1 C68.1 L13.2 U17.3 U18.5(GND2) U19.4(-Vout)
GND: C66.1 C69.1 C70.1 U18.4(GND1) U19.2(-Vin) ; port GND
CAN_GND: L13.1 ; port CAN_GND  [a separate net that carries the same name]
CAN_H: L12.1 ; port CAN_H
CAN_L: L12.4 ; port CAN_L
CAN_PHY_RX: R95.2 ; port CAN.CAN_RX
CAN_PHY_TX: R97.2 ; port CAN.CAN_TX
NetC64_2: C64.2 J20.2
NetJ19_1: J19.1 L12.2 U17.1 U18.7(CAN_H)
NetJ19_2: J19.2 R94.2
NetJ20_1: J20.1 R94.1 R96.2
NetJ21_1: J21.1 R96.1
NetJ21_2: J21.2 L12.3 U17.2 U18.6(CAN_L)
NetR95_1: R95.1 U18.2(RXD)
NetR97_1: R97.1 U18.3(TXD)

Not connected (* = marked no-connect by the designer): U19 5(NC) 7(NC)

### Channels
U_can_phy: designators end in _1; ports +3.3VD=+3.3VD +5VIN=+5VME CAN_GND=CAN0_G CAN_H=CAN0_H CAN_L=CAN0_L GND=GND
U_can_phy: designators end in _2; ports +3.3VD=+3.3VD +5VIN=+5VME CAN_GND=CAN1_G CAN_H=CAN1_H CAN_L=CAN1_L GND=GND

### Notes on the sheet
- (in symbol ISO1050DU) Galvanic isolation

### Library data of the parts
C64 = CAPC: as C59 on sheet ethernet_1gbe_ext_magn; PartField: 1nF; Last Change Data: 06.03.2017; Release Date: 06.03.2017; VoltageRating: 2kV
C65-C67 C69 = CAPC: as C34-C38 on sheet uart_adm3222; PartField: 0.1uF; Last Change Data: 06.03.2017; Release Date: 06.03.2017; Value: 0.1uF
C68 C70 = CAPC: Generic ceramic SMD capacitor; Pkg: 1006; Maintainer: Evgeniy Kotov; SMD Solders: 2; THD Solders: 0; PartField: 47uF; Last Change Data: 06.03.2017; Release Date: 06.03.2017; Value: 47uF
J19-J21 = PLS-2: Connector, 5x2, Male, 2.54mm Pitch, Right Angle; SMD Solders: 0; THD Solders: 2; Maintainer: Evgeniy Kotov; PartField: PLS-2; Last Change Data: 02.04.2017; Release Date: 02.04.2017; Value: PLS-2; ComponentLink1Description: Datasheet; Pkg: PLS-2
L12 = B82790C0513: Pkg: SMD 4 pin; SMD Solders: 4; THD Solders: 0; Vendor: Epcos; PartField: B82790C0513; Value: B82790C0513
L13 = LQH32PN4R7NN0L: Inductor, Fixed, 1210, 4.7uH, 216mOhm, 1A, 30%; Pkg: 1210; Vendor: Murata; Maintainer: Evgeniy Kotov; SMD Solders: 2; THD Solders: 0; DC Current: 750mA; Tolerance: 20%; DC Resistance: 380mΩ; PartField: LQH32PN4R7NN0L; Release Date: 30.03.2017; Last Change Data: 30.03.2017; Temperature Range: -40°C to +105°C
R94 R96 = RESC: as R88-R93 on sheet ethernet_1gbe_ext_magn; PartField: 62Ω; Release Date: 06.03.2017; Last Change Data: 09.03.2017; Value: 62Ω
R95 R97 = RESC: as R52 on sheet uart_adm3222; PartField: 22Ω; Release Date: 06.03.2017; Last Change Data: 09.03.2017; Value: 22Ω
U17 = SM712: Pkg: SOT23-3; SMD Solders: 3; THD Solders: 0; Vendor: SemTech; ComponentLink1Description: Datasheet; ComponentLink1URL: https://static.chipdip.ru/lib/081/DOC001081416.pdf; Last Change Data: 05.03.2020; PartField: SM712; Value: SM712
U18 = ISO1050DU: Order: main; Pkg: SOP-8; SMD Solders: 8; THD Solders: 0; PartField: ISO1050DU; Value: ISO1050DU
U19 = AM1D-0505S-N: AM3G-0505DZ; Manufactuer: Aimtec; SolderOption: 0; Pkg: SIP-7pin; THD Solders: 7; HelpURL: http://www.aimtec.com/site/Aimtec/files/Datasheet/HighResolution/AM1D-NZ.pdf; Manufacturer: Aimtec; PartField: AM1D-0505S-N; Value: AM1D-0505S-N; Vendor: Aimtec; SMD Solders: 0

## Sheet Power_3V3_LDO.SchDoc
size A4
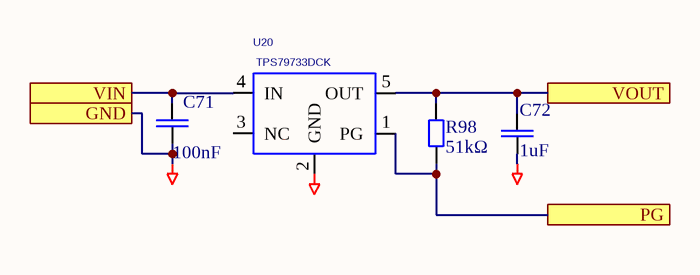
[diagram p10: Power_3V3_LDO.SchDoc]

### Parts
C71  100nF  [CAPC1608N]
C72  1uF  [CAPC2012N]
R98  51kΩ  [RESC2012N]
U20  TPS79733DCK  [SOT65P210X110-5N]

### Ports
GND, PG, VIN, VOUT

### Nets
+5VSTBY: C71.2 U20.4(IN) ; port VIN
GND: C71.1 C72.1 U20.2(GND) ; port GND
3V3BATLDO: C72.2 R98.2 U20.5(OUT) ; port VOUT
NetR98_1: R98.1 U20.1(PG) ; port PG

Not connected (* = marked no-connect by the designer): U20 3(NC)

### Library data of the parts
C71 = CAPC: as C39-C41 on sheet sdcard_emmc; PartField: 100nF; Last Change Data: 06.03.2017; Release Date: 06.03.2017; Value: 100nF
C72 = CAPC: as C57 on sheet ethernet_1gbe_ext_magn; PartField: 1uF; Last Change Data: 06.03.2017; Release Date: 06.03.2017; Value: 1uF
R98 = RESC: as R88-R93 on sheet ethernet_1gbe_ext_magn; PartField: 51kΩ; Release Date: 06.03.2017; Last Change Data: 09.03.2017; Value: 51kΩ
U20 = TPS79733DCK: Ultra low power (Iq=1.2 mkA) LDO 3.3V Fixed; Vendor: Texas Instruments; PACKAGE_DESIGNATOR: MF; PIN_COUNT: 5; INDUSTRY_STD_PKG_TYPE: SC70-5; THD Solders: 0; Value: TPS79733DCK; Manufacturer_Part_Number: TPS79733DCK; GENERIC_PART_NUMBER: TPS79733DCK; FAMILY_NAME: LDO; HelpURL: http://www.ti.com/lit/ds/symlink/tps797.pdf; Manufacturer: Texas Instruments; Pkg: SC70-5; SMD Solders: 5; PartField: TPS79733DCK

## Sheet SFPplusConn.SchDoc
size A4
Used 4 times, as channels U_SFPplusConn_0, U_SFPplusConn_1, U_SFPplusConn_2, U_SFPplusConn_3. Parts and nets are listed once, with the designators drawn on the sheet.
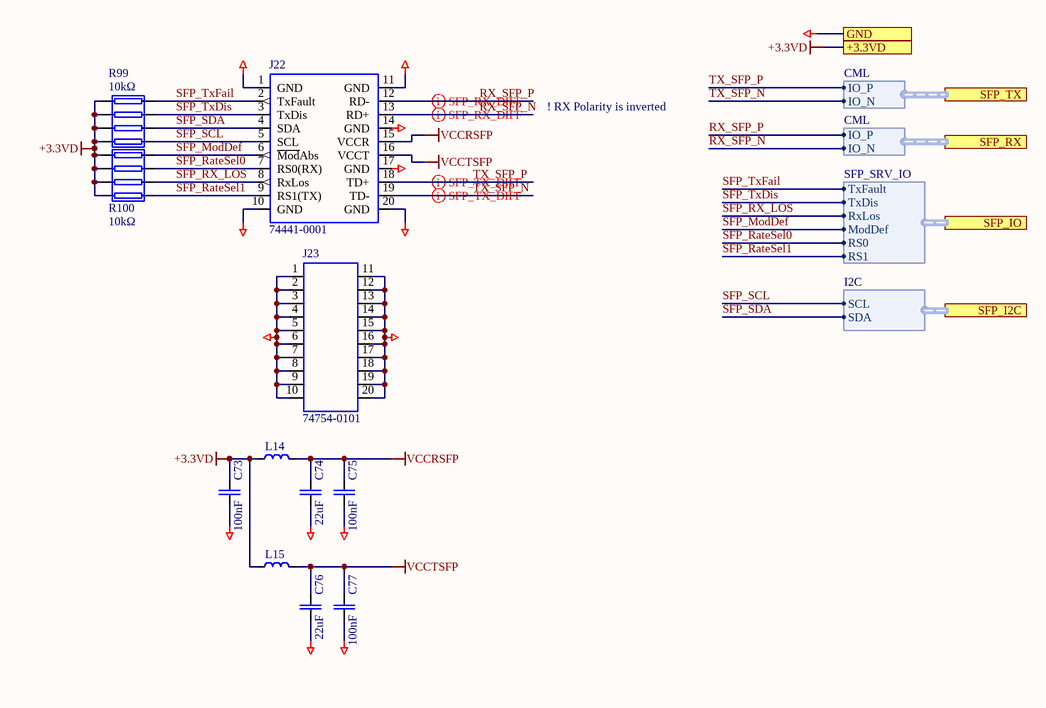
[diagram p11: SFPplusConn.SchDoc]

### Parts
C73  100nF  [CAPC1608N]
C74  22uF  [CAPC2012N]
C75  100nF  [CAPC1608N]
C76  22uF  [CAPC2012N]
C77  100nF  [CAPC1608N]
J22  74441-0001  [MOLEX_74441-0001]
J23  74754-0101  [MOLEX_74737-0111]
L14  BLM21PG221SN1  [INDC2012N]  (value not drawn)
L15  BLM21PG221SN1  [INDC2012N]  (value not drawn)
R99  value 10kΩ  [CAY16-J4]  (hidden comment: CAY16-1002F4LF)
R100  value 10kΩ  [CAY16-J4]  (hidden comment: CAY16-1002F4LF)

### Ports
+3.3VD, GND, SFP_I2C (harness I2C), SFP_IO (harness SFP_SRV_IO), SFP_RX (harness CML), SFP_TX (harness CML)

### Harnesses
CML: IO_N, IO_P
SFP_SRV_IO: TxDis, TxFault, RS0, RS1, ModDef, RxLos
I2C: SDA, SCL

### Nets
+3.3VD: C73.2 L14.1 L15.1 R99.1 R99.2 R99.3 R99.4 R100.1 R100.2 R100.3 R100.4 ; port +3.3VD
GND: C73.1 C74.1 C75.1 C76.1 C77.1 J22.1(GND) J22.10(GND) J22.11(GND) J22.14(GND) J22.17(GND) J22.20(GND) J23.1 J23.2 J23.3 J23.4 J23.5 J23.6 J23.7 J23.8 J23.9 J23.10 J23.11 J23.12 J23.13 J23.14 J23.15 J23.16 J23.17 J23.18 J23.19 J23.20 ; port GND
VCCRSFP: C74.2 C75.2 J22.15(VCCR) L14.2
VCCTSFP: C76.2 C77.2 J22.16(VCCT) L15.2
RX_SFP_N: J22.13(RD+) ; port SFP_RX.IO_N
RX_SFP_P: J22.12(RD-) ; port SFP_RX.IO_P
SFP_ModDef: J22.6(~{Mod}Abs) R100.8 ; port SFP_IO.ModDef
SFP_RateSel0: J22.7(RS0(RX)) R100.7 ; port SFP_IO.RS0
SFP_RateSel1: J22.9(RS1(TX)) R100.5 ; port SFP_IO.RS1
SFP_RX_LOS: J22.8(RxLos) R100.6 ; port SFP_IO.RxLos
SFP_SCL: J22.5(SCL) R99.5 ; port SFP_I2C.SCL
SFP_SDA: J22.4(SDA) R99.6 ; port SFP_I2C.SDA
SFP_TxDis: J22.3(TxDis) R99.7 ; port SFP_IO.TxDis
SFP_TxFail: J22.2(TxFault) R99.8 ; port SFP_IO.TxFault
TX_SFP_N: J22.19(TD-) ; port SFP_TX.IO_N
TX_SFP_P: J22.18(TD+) ; port SFP_TX.IO_P

### Channels
U_SFPplusConn_0: designators end in _1; ports +3.3VD=+3.3VD GND=GND
U_SFPplusConn_1: designators end in _2; ports +3.3VD=+3.3VD GND=GND
U_SFPplusConn_2: designators end in _3; ports +3.3VD=+3.3VD GND=GND
U_SFPplusConn_3: designators end in _4; ports +3.3VD=+3.3VD GND=GND

### Layout directives
differential pair; rule Differential Pairs Routing [Pref Gap = 0.175mm    Min Gap  = 0.075mm    Max Gap  = 0.5mmPref Width = 0.25mm    Min Width  = 0.075mm    Max Width  = 0.5mm]: SFP_RX_0.IO_N, SFP_RX_0.IO_P, SFP_TX_0.IO_N, SFP_TX_0.IO_P

### Notes on the sheet
- ! RX Polarity is inverted

### Library data of the parts
C73 C75 C77 = CAPC: as C39-C41 on sheet sdcard_emmc; PartField: 100nF; Last Change Data: 06.03.2017; Release Date: 06.03.2017; Value: 100nF
C74 C76 = CAPC: as C34-C38 on sheet uart_adm3222; PartField: 22uF; Last Change Data: 06.03.2017; Release Date: 06.03.2017; Value: 22uF
J22 = MOLEX-74441-0001: CONN SFP+ RCPT 20POS SLD R/A SMD; Pkg: SMD SFP conn; SMD Solders: 20; THD Solders: 0; RoHSCompliant: True; ComponentLink3URL: http://www.molex.com/pdm_docs/sd/747540101_sd.pdf; Width: 49 mm; Height: 10.85 mm; Mounting Technology: Through Hole; ComponentLink2Description: Datasheet; ComponentLink3Description: Package Specification; DatasheetVersion: Rev. Jul-15; Package Quantity: 1152; PackageDescription: CONN SFP+ RCPT 20POS SLD R/A SMD; Radiation Hardening: No; PackageVersion: Rev. J, 02/2015; ComponentLink1Description: Manufacturer URL; PartNumber: 74441-0001; ComponentLink1URL: http://www.molex.com/; Packaging: Tray; Length: 15.9 mm; ComponentLink2URL: http://www.molex.com/webdocs/datasheets/pdf/en-us/0747540101_IO_CONNECTORS.pdf; Value: 74441-0001; PartField: 74441-0001
J23 = MOLX-74754-0101: SFP+ Cage, Single Port, Height 10.85 mm, Tail Height 3.05 mm, -40 to 85 degC, RoHS, Tray; Pkg: SFP cage; SMD Solders: 0; THD Solders: 20; RoHSCompliant: True; ComponentLink3URL: http://www.molex.com/pdm_docs/sd/747540101_sd.pdf; Width: 49 mm; Height: 10.85 mm; Mounting Technology: Through Hole; ComponentLink2Description: Datasheet; ComponentLink3Description: Package Specification; DatasheetVersion: Rev. Jul-15; Package Quantity: 1152; PackageDescription: SFP+ Cage, Single Port, Height 10.85 mm, Tail Height 3.05 mm; Radiation Hardening: No; PackageVersion: Rev. J, 02/2015; ComponentLink1Description: Manufacturer URL; PartNumber: 74754-0101; ComponentLink1URL: http://www.molex.com/; Packaging: Tray; Length: 15.9 mm; ComponentLink2URL: http://www.molex.com/webdocs/datasheets/pdf/en-us/0747540101_IO_CONNECTORS.pdf; Value: 74754-0101; PartField: 74754-0101
L14 L15 = BLM21PG221SN1: Ferrite Beads, 0805, 220 Ohm, 2A; Pkg: 0805; Vendor: Murata; Maintainer: Evgeniy Kotov; SMD Solders: 2; THD Solders: 0; DC Current: 200mA; Tolerance: 25%; DC Resistance: 50mΩ; PartField: BLM21PG221SN1; Release Date: 30.03.2017; Last Change Data: 30.03.2017; Temperature Range: -55°C to +125°C; Value: BLM21PG221SN1
R99 R100 = RESPACK4: Maintainer: Anton Pavlenko; Pkg: SMD 8pin; SMD Solders: 8; THD Solders: 0; PartField: CAY16-1002F4LF; Last Change Data: 16.05.2019; Release Date: 16.05.2019

## Sheet RFCtl.SchDoc
size 420 x 297 mm; Address1: Address1; Address2: Address2; Address3: Address3; Address4: Address4; SheetNumber: 1; Scale: 1:1; Разраб.: Иванов; Обозначение документа: АБВГ.123456.001 Э3; Пров.: Петров; Утв.: Сидоров; Наименование организации: ОАО "Концерн "МПО-Гидроприбор"; Перв. применение: АБВГ.123456.000; Наименование изделия 1: Плата; Наименование изделия 2: Схема электрическая; Наименование изделия 3: принципиальная; Нач. отд.: Нач. отд.; Фамилия нач. отд.: Сидоров
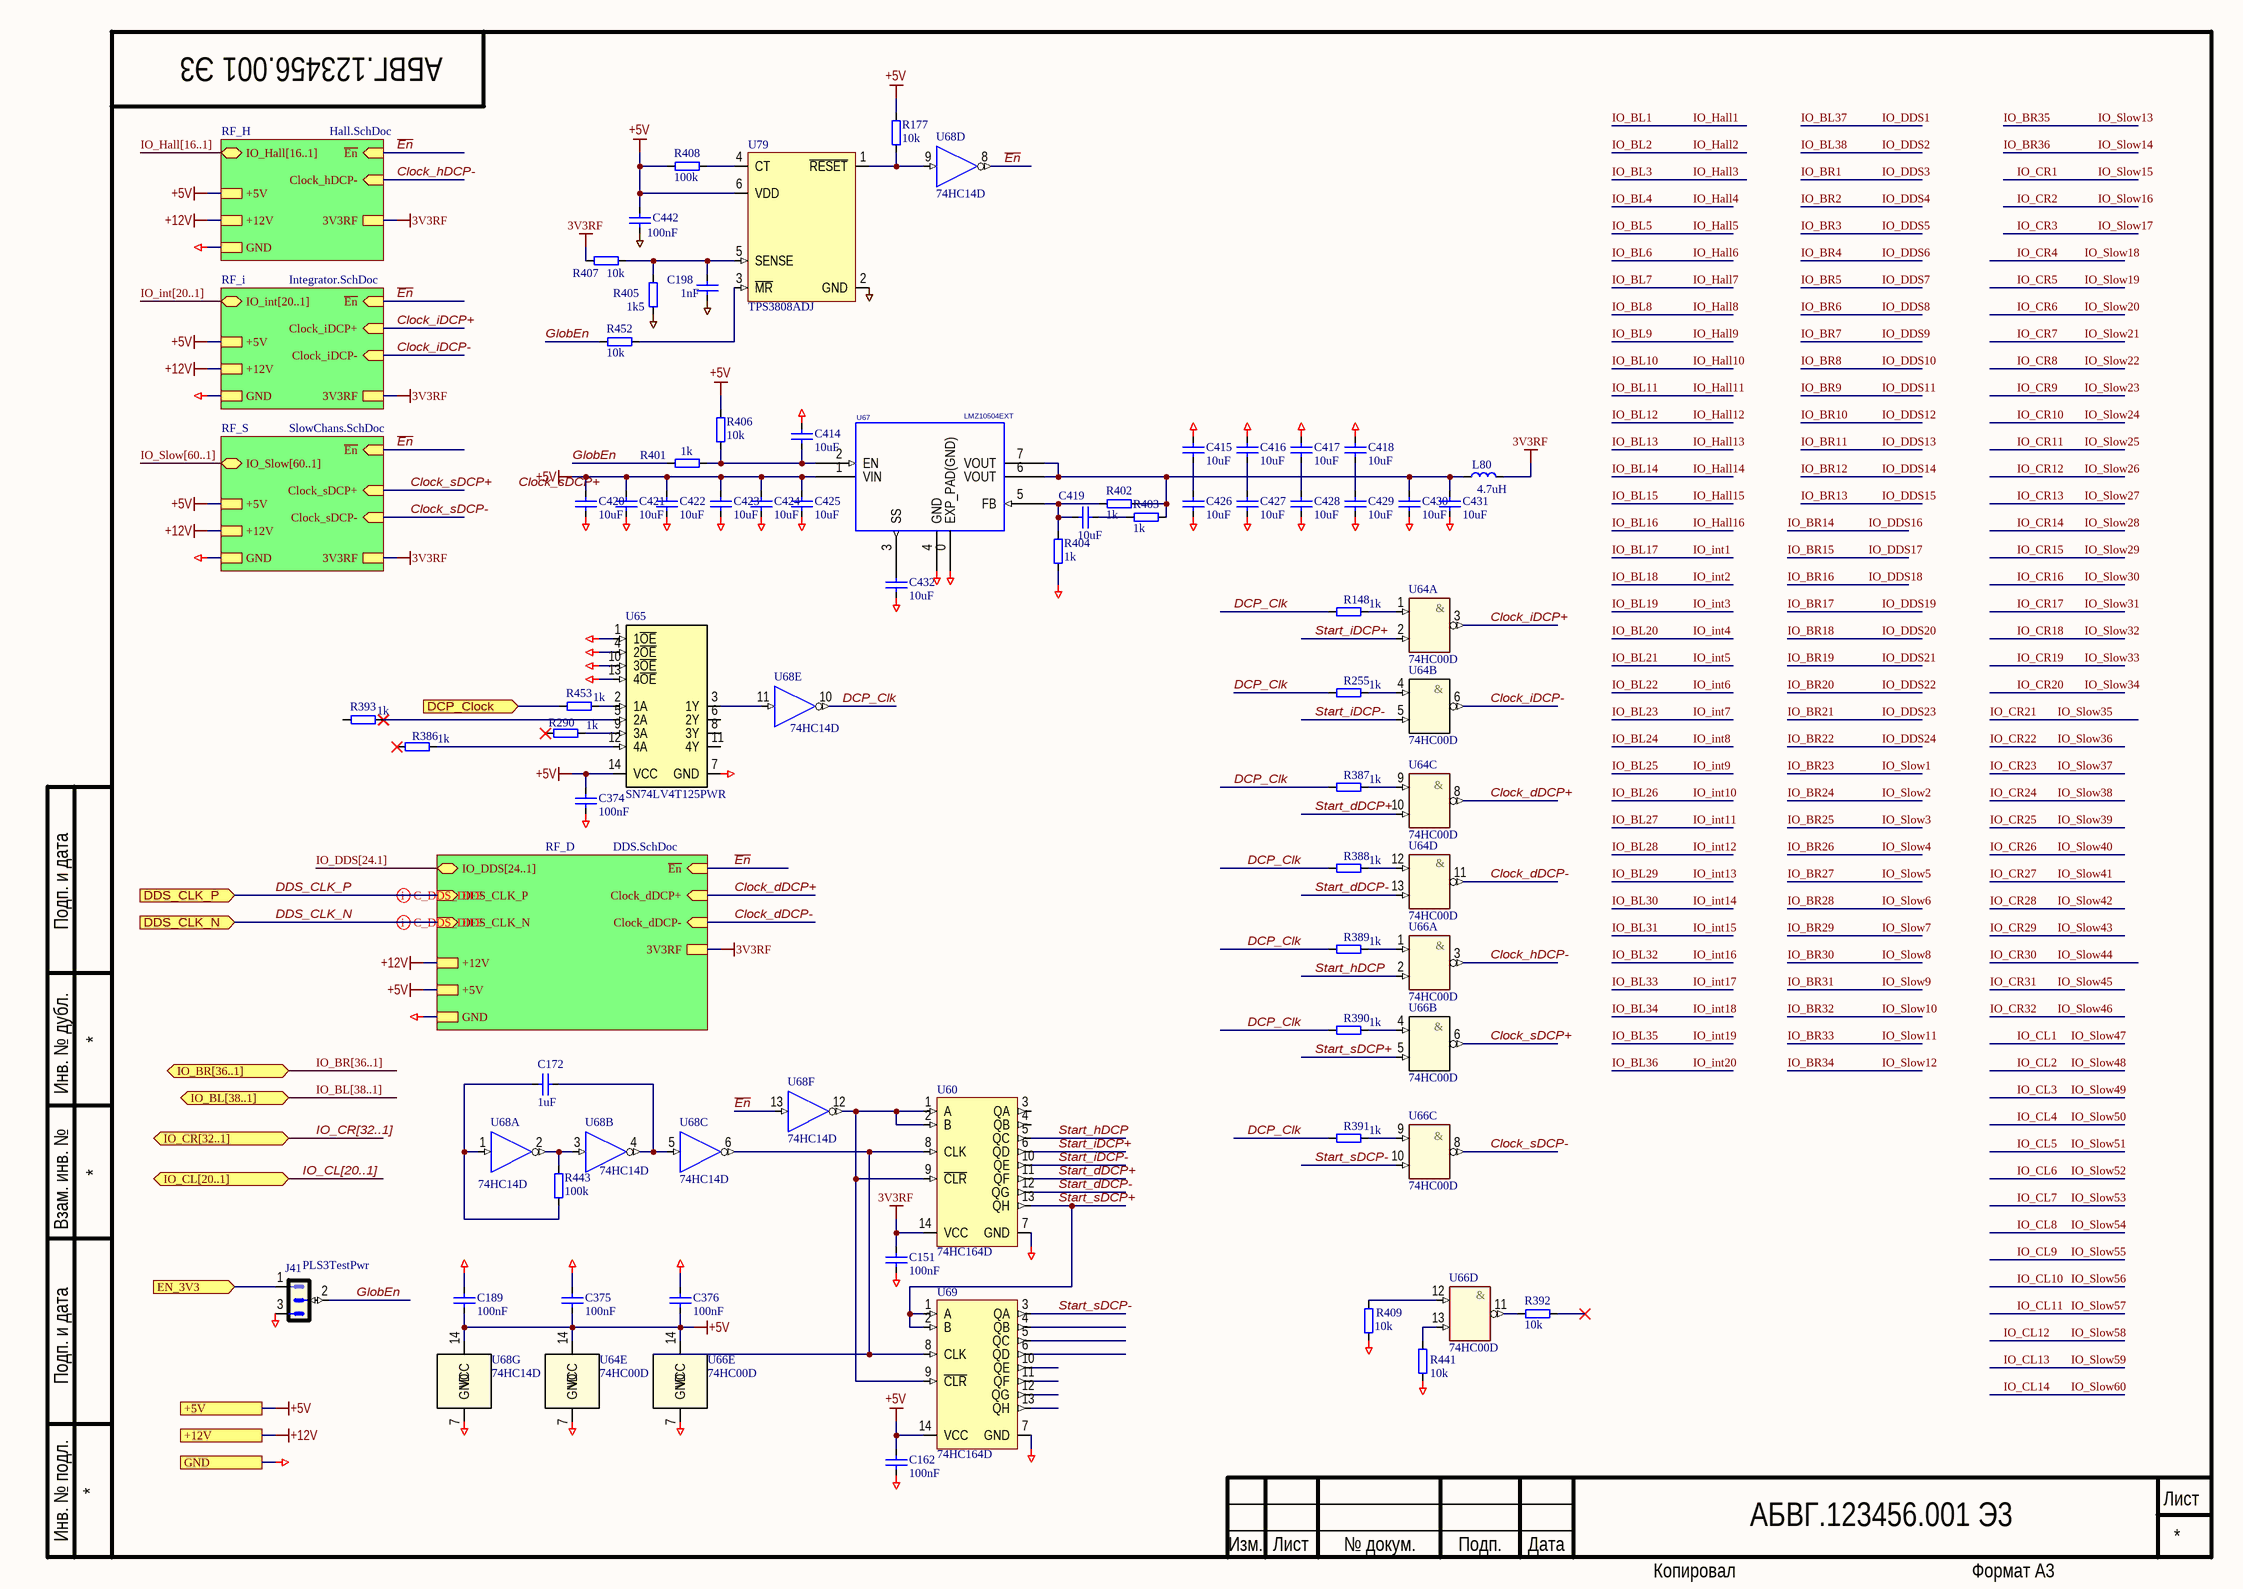
[diagram p12: RFCtl.SchDoc]

### Parts
C151  100nF  [SMD0805CAP]
C162  100nF  [SMD0805CAP]
C172  1uF  [SMD0805CAP]
C189  100nF  [SMD0805CAP]
C198  1nF  [SMD0805CAP]
C374  100nF  [SMD0805CAP]
C375  100nF  [SMD0805CAP]
C376  100nF  [SMD0805CAP]
C414  10uF  [SMD0805CAP]
C415  10uF  [SMD0805CAP]
C416  10uF  [SMD0805CAP]
C417  10uF  [SMD0805CAP]
C418  10uF  [SMD0805CAP]
C419  10uF  [SMD0805CAP]
C420  10uF  [SMD0805CAP]
C421  10uF  [SMD0805CAP]
C422  10uF  [SMD0805CAP]
C423  10uF  [SMD0805CAP]
C424  10uF  [SMD0805CAP]
C425  10uF  [SMD0805CAP]
C426  10uF  [SMD0805CAP]
C427  10uF  [SMD0805CAP]
C428  10uF  [SMD0805CAP]
C429  10uF  [SMD0805CAP]
C430  10uF  [SMD0805CAP]
C431  10uF  [SMD0805CAP]
C432  10uF  [SMD0805CAP]
C442  100nF  [SMD0805CAP]
J41  PLS3TestPwr  [PLS3]
L80  value 4.7uH  [IND_3225_MURATA_LQH_N]  (hidden comment: LQH32PN4R7NN0L)
R148  1k  [SMD0805RES]
R177  10k  [SMD0805RES]
R255  1k  [SMD0805RES]
R290  1k  [SMD0805RES]
R386  1k  [SMD0805RES]
R387  1k  [SMD0805RES]
R388  1k  [SMD0805RES]
R389  1k  [SMD0805RES]
R390  1k  [SMD0805RES]
R391  1k  [SMD0805RES]
R392  10k  [SMD0805RES]
R393  1k  [SMD0805RES]
R401  1k  [SMD0805RES]
R402  1k  [SMD0805RES]
R403  1k  [SMD0805RES]
R404  1k  [SMD0805RES]
R405  1k5  [SMD0805RES]
R406  10k  [SMD0805RES]
R407  10k  [SMD0805RES]
R408  100k  [SMD0805RES]
R409  10k  [SMD0805RES]
R441  10k  [SMD0805RES]
R443  100k  [SMD0805RES]
R452  10k  [SMD0805RES]
R453  1k  [SMD0805RES]
U60  74HC164D  [SOIC127P600X175-14N]
U64  74HC00D  [SOIC127P600X175-14N]  (parts A,B,C,D,E of 5)
U65  SN74LV4T125PWR  [SOP65P640X120-14N]
U66  74HC00D  [SOIC127P600X175-14N]  (parts A,B,C,D,E of 5)
U67  LMZ10504EXT  [TO-PMOD7]
U68  74HC14D  [SOIC127P600X175-14N]  (parts A,B,C,D,E,F,G of 7)
U69  74HC164D  [SOIC127P600X175-14N]
U79  TPS3808ADJ  [SOT95P270X145-6N]

### Sub-sheets
RF_D = DDS.SchDoc: IO_DDS[24..1] (bidir), ~{En} (in), Clock_dDCP- (in), Clock_dDCP+ (in), DDS_CLK_N (in), DDS_CLK_P (in), GND, +5V, 3V3RF, +12V
RF_H = Hall.SchDoc: IO_Hall[16..1] (bidir), ~{En} (in), Clock_hDCP- (in), GND, +12V, +5V, 3V3RF
RF_i = Integrator.SchDoc: IO_int[20..1] (bidir), ~{En} (in), Clock_iDCP- (in), Clock_iDCP+ (in), GND, +12V, +5V, 3V3RF
RF_S = SlowChans.SchDoc: IO_Slow[60..1] (bidir), ~{En} (in), Clock_sDCP- (in), Clock_sDCP+ (in), +5V, +12V, GND, 3V3RF

### Ports
+5V, +12V, DCP_Clock (in), DDS_CLK_N (in), DDS_CLK_P (in), EN_3V3 (in), GND, IO_BL[38..1] (bidir), IO_BR[36..1] (bidir), IO_CL[20..1] (bidir), IO_CR[32..1] (bidir)

### Nets
3V3RF: C151.2 L80.2 R407.1 U60.14(VCC) ; sheet RF_H/3V3RF, sheet RF_i/3V3RF, sheet RF_D/3V3RF, sheet RF_S/3V3RF
+5V: C162.2 C189.1 C374.2 C375.1 C376.1 C420.2 C421.2 C422.2 C423.2 C424.2 C425.2 C442.2 R177.1 R406.2 R408.1 U64.14(VCC) U65.14(VCC) U66.14(VCC) U67.1(VIN) U68.14(VCC) U69.14(VCC) U79.6(VDD) ; port +5V, sheet RF_H/+5V, sheet RF_i/+5V, sheet RF_D/+5V, sheet RF_S/+5V
+12V: port +12V, sheet RF_H/+12V, sheet RF_i/+12V, sheet RF_D/+12V, sheet RF_S/+12V
GND: C151.1 C162.1 C189.2 C198.1 C374.1 C375.2 C376.2 C414.2 C415.2 C416.2 C417.2 C418.2 C420.1 C421.1 C422.1 C423.1 C424.1 C425.1 C426.1 C427.1 C428.1 C429.1 C430.1 C431.1 C432.1 C442.1 J41.3 R404.2 R405.1 R409.1 R441.1 U60.7(GND) U64.7(GND) U65.1(1~{OE}) U65.4(2~{OE}) U65.7(GND) U65.10(3~{OE}) U65.13(4~{OE}) U66.7(GND) U67.0(EXP_PAD(GND)) U67.4(GND) U68.7(GND) U69.7(GND) U79.2(GND) ; port GND, sheet RF_H/GND, sheet RF_i/GND, sheet RF_D/GND, sheet RF_S/GND
~{En}: U68.8(OUT) U68.13(IN) ; sheet RF_H/~{En}, sheet RF_i/~{En}, sheet RF_D/~{En}, sheet RF_S/~{En}
Clock_dDCP+: U64.8(OUT) ; sheet RF_D/Clock_dDCP+
Clock_dDCP-: U64.11(OUT) ; sheet RF_D/Clock_dDCP-
Clock_hDCP-: U66.3(OUT) ; sheet RF_H/Clock_hDCP-
Clock_iDCP+: U64.3(OUT) ; sheet RF_i/Clock_iDCP+
Clock_iDCP-: U64.6(OUT) ; sheet RF_i/Clock_iDCP-
Clock_sDCP+: U66.6(OUT) ; sheet RF_S/Clock_sDCP+
Clock_sDCP-: U66.8(OUT) ; sheet RF_S/Clock_sDCP-
DCP_Clk: R148.2 R255.2 R387.2 R388.2 R389.2 R390.2 R391.2 U68.10(OUT)
DDS_CLK_N: port DDS_CLK_N, sheet RF_D/DDS_CLK_N
DDS_CLK_P: port DDS_CLK_P, sheet RF_D/DDS_CLK_P
EN_3V3: J41.1 ; port EN_3V3
GlobEn: J41.2 R401.2 R452.2
IO_CL21: R453.2 ; port DCP_Clock
Start_dDCP+: U60.11(QF) U64.10(IN)
Start_dDCP-: U60.12(QG) U64.13(IN)
Start_hDCP: U60.5(QC) U66.2(IN)
Start_iDCP+: U60.6(QD) U64.2(IN)
Start_iDCP-: U60.10(QE) U64.5(IN)
Start_sDCP+: U60.13(QH) U66.5(IN) U69.1(A) U69.2(B)
Start_sDCP-: U66.10(IN) U69.3(QA)
NetC172_1: C172.1 U68.4(OUT) U68.5(IN)
NetC172_2: C172.2 R443.1 U68.1(IN)
NetC198_2: C198.2 R405.2 R407.2 U79.5(SENSE)
NetC414_1: C414.1 R401.1 R406.1 U67.2(EN)
NetC415_1: C415.1 C426.2
NetC416_1: C416.1 C427.2
NetC417_1: C417.1 C428.2
NetC418_1: C418.1 C429.2
NetC419_1: C419.1 R403.2
NetC419_2: C419.2 R402.2 R404.1 U67.5(FB)
NetC430_2: C430.2 C431.2 L80.1 R402.1 R403.1 U67.6(VOUT) U67.7(VOUT)
NetC432_2: C432.2 U67.3(SS)
NetR148_1: R148.1 U64.1(IN)
NetR177_2: R177.2 U68.9(IN) U79.1(~{RESET})
NetR255_1: R255.1 U64.4(IN)
NetR290_1: R290.1 U65.9(3A)
NetR386_1: R386.1 U65.12(4A)
NetR387_1: R387.1 U64.9(IN)
NetR388_1: R388.1 U64.12(IN)
NetR389_1: R389.1 U66.1(IN)
NetR390_1: R390.1 U66.4(IN)
NetR391_1: R391.1 U66.9(IN)
NetR392_2: R392.2 U66.11(OUT)
NetR393_1: R393.1 U65.5(2A)
NetR408_2: R408.2 U79.4(CT)
NetR409_2: R409.2 U66.12(IN)
NetR441_2: R441.2 U66.13(IN)
NetR443_2: R443.2 U68.2(OUT) U68.3(IN)
NetR452_1: R452.1 U79.3(~{MR})
NetR453_1: R453.1 U65.2(1A)
NetU60_1: U60.1(A) U60.2(B) U60.9(~{CLR}) U68.12(OUT) U69.9(~{CLR})
NetU60_8: U60.8(CLK) U68.6(OUT) U69.8(CLK)
NetU65_3: U65.3(1Y) U68.11(IN)

Not connected (* = marked no-connect by the designer): R290 2*; R386 2*; R392 1*; R393 2; U60 3(QA) 4(QB); U65 6(2Y) 8(3Y) 11(4Y); U69 4(QB) 5(QC) 6(QD) 10(QE) 11(QF) 12(QG) 13(QH)

### Buses and harness runs
bus IO_BL[38..1] = port IO_BL[38..1]
bus IO_BR[36..1] = port IO_BR[36..1]
bus IO_CL[20..1] = port IO_CL[20..1]
bus IO_CR[32..1] = port IO_CR[32..1]
bus IO_DDS[24.1] = sheet RF_D/IO_DDS[24..1]
bus IO_Hall[16..1] = sheet RF_H/IO_Hall[16..1]
bus IO_int[20..1] = sheet RF_i/IO_int[20..1]
bus IO_Slow[60..1] = sheet RF_S/IO_Slow[60..1]

### Layout directives
differential pair; rule Differential Pairs Routing [Pref Gap = 0.175mm    Min Gap  = 0.075mm    Max Gap  = 0.5mmPref Width = 0.25mm    Min Width  = 0.075mm    Max Width  = 0.5mm]: DDS_CLK_N, DDS_CLK_P

### Notes on the sheet
- Labels drawn without touching a wire or pin: Clock_sDCP+
- Подп. и дата
- Инв. № дубл.
- Взам. инв. №
- Инв. № подл.
- Изм.
- Лист
- № докум.
- Подп.
- Дата
- Копировал
- Формат А3
- (in symbol 74HC00D, part A) &
- (in symbol 74HC00D, part B) &
- (in symbol 74HC00D, part C) &
- (in symbol 74HC00D, part D) &

### Library data of the parts
C151 C162 C172 C189 C198 C374-C376 C442 = C0805: Чип конденсатор 0805; Voltage: 25V; Vendor: Vishay; DielectricType: X5R; SMD Solders: 2; Solder Option: RM; Tolerance: 20%; Pkg: SMD0805; Device: Cap0805; Price: 2
  C151 C162 C189 C374-C376 C442: Value: 100nF
  C172: Value: 1uF
  C198: Value: 1nF
C414-C432 = C0805: Чип конденсатор 0805; Pkg: SMD0805; Vendor: Vishay; SMD Solders: 2; Tolerance: 20%; Voltage: 25V; DielectricType: X5R; Solder Option: RM; Device: Cap0805; Value: 10uF; Price: 2
J41 = PLS3: Vendor: Confly; SMD Solders: 0; Solder Option: RM; THD Solders: 3; Price: 1; Value: TestPwr; Device: PLS3
L80 = LQH32PN4R7NN0L: as L13 on sheet can_phy; PartField: LQH32PN4R7NN0L; Release Date: 30.03.2017; Last Change Data: 30.03.2017; Temperature Range: -40°C to +105°C
R148 R255 R290 R386-R391 R401-R404 = R0805: Чип резистор 0805; Pkg: SMD0805; Vendor: Vishay; SMD Solders: 2; Tolerance: 1%; Solder Option: RM; TC: 100ppm/C; Pwr: 125mW; Device: Res0805; Value: 1k; Price: 2
R177 R392 R393 R405-R407 R409 R441 R443 R452 R453 = R0805: Чип резистор 0805; Vendor: Vishay; SMD Solders: 2; Solder Option: RM; TC: 100ppm/C; Tolerance: 1%; Pkg: SMD0805; Pwr: 125mW; Device: Res0805; Price: 2
  R177 R392 R406 R407 R409 R441 R452: Value: 10k
  R393 R453: Value: 1k
  R405: Value: 1k5
  R443: Value: 100k
R408 = R0805: Чип резистор 0805; Vendor: Vishay; SMD Solders: 2; Solder Option: Dbg; TC: 100ppm/C; Tolerance: 1%; Pkg: SMD0805; Pwr: 125mW; Device: Res0805; Price: 2; Value: 100k
U60 U69 = 74HC164D: Сдвиговый регистр. Посл. вх. 8 разр. выход.; Pkg: SOIC14; SMD Solders: 14; Solder Option: RM; THD Solders: 0; Vendor: NXP; Voltage: 2V0.. 6V0; Device: 74HC164D; Price: 30; Name to order: 74HC164D
U64 U66 = 74HC00D: 4 лог. элемента 2И-НЕ; Vendor: NXP; Pkg: SOIC14; SMD Solders: 14; Solder Option: RM; Voltage: 2.. 6V; Price: 50; Device: 74HC00D; Name to order: 74HC00D
U65 = SN74LV4T125PWR: Quadruple Buffer Translator GATE With 3-State / Output CMOS Logic Level Shifter; Pkg: TSSOP14; SMD Solders: 14; Solder Option: RM; THD Solders: 0; Vendor: Texas Instruments; Voltage: 2V0.. 6V0; Device: SN74LV4T125PWR; Price: 30; Name to order: SN74LV4T125PWR
U67 = LMZ10504EXT_NDW: 4A, SIMPLE SWITCHER® Power Module with 5.5V Maximum Input Voltage for Military and Rugged Applications; Manufacturer: Texas Instruments; Manufacturer_Part_Number: lmz10504ext_ndw_7; NSC_PackageReference: TZA07A; Pkg: PMOD-7EP; SMD Solders: 8; THD Solders: 0; Value: LMZ10504EXT; HelpURL: http://www.ti.com/lit/ds/symlink/lmz10504ext.pdf; basePN: LMZ10504EXT; Vendor: Texas Instruments; PartField: LMZ10504EXT
U68 = 74HC14D: 6 триггеров Шмита с инверсией.; Vendor: NXP; Pkg: SOIC14; SMD Solders: 14; Solder Option: RM; Voltage: 2.. 6V; Price: 50; Device: 74HC14D; Name to order: 74HC14D
U79 = TPS3808: Supervisory Circuit. Low-Quiescent-Current, Programmable-Delay; Vendor: Texas Instruments; Value: ADJ; Pkg: SOT23-6; SMD Solders: 6; Solder Option: RM; THD Solders: 0; Name to order: TPS3808G01DBV; Current: 6uA; thVoltage: 400mV; Price: 200; Device: TPS3808